# Altium project 191228 Precharge Controller R1.PrjPcb
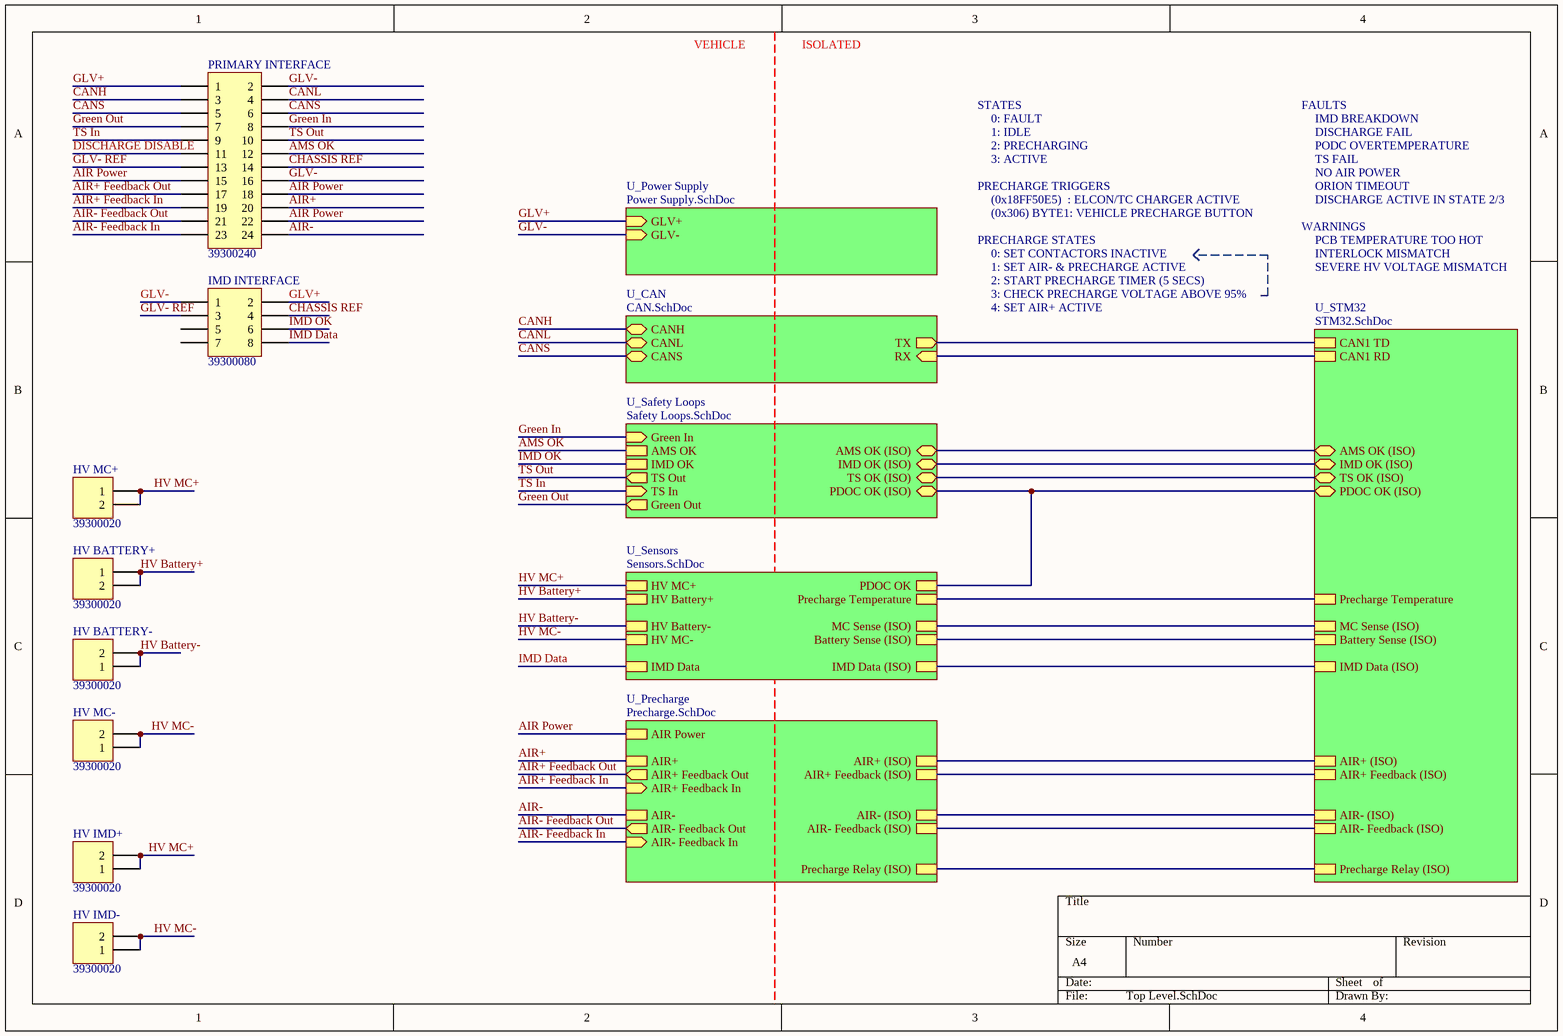
[diagram p0: Top Level.SchDoc]
7 sheets, 260 parts. Net scope: hierarchical (ports join the sheet entries above them; power ports are global).
Board file: 191228 PCB.PcbDoc
Sheets:
  Top Level.SchDoc
    U_CAN = CAN.SchDoc
    U_Power Supply = Power Supply.SchDoc
    U_STM32 = STM32.SchDoc
    U_Safety Loops = Safety Loops.SchDoc
    U_Precharge = Precharge.SchDoc
    U_Sensors = Sensors.SchDoc

## Sheet Top Level.SchDoc
size A4

### Parts
HV_BATTERY+  39300020  [39300020]
HV_BATTERY-  39300020  [39300020]
HV_IMD+  39300020  [39300020]
HV_IMD-  39300020  [39300020]
HV_MC+  39300020  [39300020]
HV_MC-  39300020  [39300020]
IMD_INTERFACE  39300080  [39300080]
PRIMARY_INTERFACE  39300240  [39300240]

### Sub-sheets
U_CAN = CAN.SchDoc: CANH (bidir), CANL (bidir), CANS (bidir), RX (in), TX (out)
U_Power Supply = Power Supply.SchDoc: GLV+ (in), GLV- (in)
U_Precharge = Precharge.SchDoc: AIR Power, AIR- (ISO), AIR- Feedback Out (out), AIR- Feedback (ISO), AIR-, AIR- Feedback In (in), AIR+, AIR+ Feedback Out (out), AIR+ (ISO), AIR+ Feedback (ISO), AIR+ Feedback In (in), Precharge Relay (ISO)
U_Safety Loops = Safety Loops.SchDoc: AMS OK, IMD OK (ISO) (bidir), AMS OK (ISO) (bidir), PDOC OK (ISO) (bidir), TS OK (ISO) (bidir), Green In (in), IMD OK, TS Out (out), TS In (in), Green Out (out)
U_Sensors = Sensors.SchDoc: PDOC OK, HV MC+, HV Battery+, HV MC-, HV Battery-, Precharge Temperature, MC Sense (ISO), Battery Sense (ISO), IMD Data, IMD Data (ISO)
U_STM32 = STM32.SchDoc: CAN1 RD, CAN1 TD, AIR+ (ISO), AIR+ Feedback (ISO), AIR- (ISO), AIR- Feedback (ISO), Precharge Relay (ISO), AMS OK (ISO) (bidir), IMD OK (ISO) (bidir), TS OK (ISO) (bidir), PDOC OK (ISO) (bidir), Precharge Temperature, MC Sense (ISO), Battery Sense (ISO), IMD Data (ISO)

### Nets
AIR+ Feedback In: PRIMARY_INTERFACE.9 PRIMARY_INTERFACE.19 PRIMARY_INTERFACE.23 ; sheet U_Safety Loops/TS In, sheet U_Precharge/AIR- Feedback In, sheet U_Precharge/AIR+ Feedback In  [also labelled AIR- Feedback In, TS In]
HV Battery-: HV_BATTERY-.1 HV_BATTERY-.2 ; sheet U_Sensors/HV Battery-
HV MC-: HV_IMD-.1 HV_IMD-.2 HV_MC-.1 HV_MC-.2 ; sheet U_Sensors/HV MC-
AIR Power: PRIMARY_INTERFACE.15 PRIMARY_INTERFACE.18 PRIMARY_INTERFACE.22 ; sheet U_Precharge/AIR Power
AIR+: PRIMARY_INTERFACE.20 ; sheet U_Precharge/AIR+
AIR+ Feedback Out: PRIMARY_INTERFACE.17 ; sheet U_Precharge/AIR+ Feedback Out
AIR-: PRIMARY_INTERFACE.24 ; sheet U_Precharge/AIR-
AIR- Feedback Out: PRIMARY_INTERFACE.21 ; sheet U_Precharge/AIR- Feedback Out
AMS OK: PRIMARY_INTERFACE.12 ; sheet U_Safety Loops/AMS OK
CANH: PRIMARY_INTERFACE.3 ; sheet U_CAN/CANH
CANL: PRIMARY_INTERFACE.4 ; sheet U_CAN/CANL
CANS: PRIMARY_INTERFACE.5 PRIMARY_INTERFACE.6 ; sheet U_CAN/CANS
CHASSIS REF: IMD_INTERFACE.4 PRIMARY_INTERFACE.14
DISCHARGE DISABLE: PRIMARY_INTERFACE.11
GLV+: IMD_INTERFACE.2 PRIMARY_INTERFACE.1 ; sheet U_Power Supply/GLV+
GLV-: IMD_INTERFACE.1 PRIMARY_INTERFACE.2 PRIMARY_INTERFACE.16 ; sheet U_Power Supply/GLV-
GLV- REF: IMD_INTERFACE.3 PRIMARY_INTERFACE.13
Green In: PRIMARY_INTERFACE.8 ; sheet U_Safety Loops/Green In
Green Out: PRIMARY_INTERFACE.7 ; sheet U_Safety Loops/Green Out
HV Battery+: HV_BATTERY+.1 HV_BATTERY+.2 ; sheet U_Sensors/HV Battery+
HV MC+: HV_IMD+.1 HV_IMD+.2 HV_MC+.1 HV_MC+.2 ; sheet U_Sensors/HV MC+
IMD Data: IMD_INTERFACE.8 ; sheet U_Sensors/IMD Data
IMD OK: IMD_INTERFACE.6 ; sheet U_Safety Loops/IMD OK
PA2: sheet U_STM32/AIR- Feedback (ISO), sheet U_Precharge/AIR- Feedback (ISO)
PA3: sheet U_STM32/AIR+ Feedback (ISO), sheet U_Precharge/AIR+ Feedback (ISO)
PA5: sheet U_STM32/AIR- (ISO), sheet U_Precharge/AIR- (ISO)
PA6: sheet U_STM32/Precharge Relay (ISO), sheet U_Precharge/Precharge Relay (ISO)
PA7: sheet U_STM32/AIR+ (ISO), sheet U_Precharge/AIR+ (ISO)
PB8: sheet U_CAN/RX, sheet U_STM32/CAN1 RD
PB9: sheet U_CAN/TX, sheet U_STM32/CAN1 TD
PB12: sheet U_STM32/IMD OK (ISO), sheet U_Safety Loops/IMD OK (ISO)
PB13: sheet U_STM32/AMS OK (ISO), sheet U_Safety Loops/AMS OK (ISO)
PB14: sheet U_STM32/TS OK (ISO), sheet U_Safety Loops/TS OK (ISO)
PB15: sheet U_STM32/PDOC OK (ISO), sheet U_Safety Loops/PDOC OK (ISO), sheet U_Sensors/PDOC OK
TS Out: PRIMARY_INTERFACE.10 ; sheet U_Safety Loops/TS Out
NetBATT_SENSE_AMP_OUT_TP1_1: sheet U_STM32/Battery Sense (ISO), sheet U_Sensors/Battery Sense (ISO)
NetC29_2: sheet U_STM32/Precharge Temperature, sheet U_Sensors/Precharge Temperature
NetC38_2: sheet U_STM32/MC Sense (ISO), sheet U_Sensors/MC Sense (ISO)
NetR52_2: sheet U_STM32/IMD Data (ISO), sheet U_Sensors/IMD Data (ISO)

Not connected (* = marked no-connect by the designer): IMD_INTERFACE 5 7

### Notes on the sheet
- VEHICLE
- ISOLATED
- STATES
- FAULTS
- 0: FAULT
- 1: IDLE
- 2: PRECHARGING
- 3: ACTIVE
- IMD BREAKDOWN
- DISCHARGE FAIL
- PODC OVERTEMPERATURE
- TS FAIL
- NO AIR POWER
- PRECHARGE STATES
- PRECHARGE TRIGGERS
- (0x18FF50E5)  : ELCON/TC CHARGER ACTIVE
- (0x306) BYTE1: VEHICLE PRECHARGE BUTTON
- WARNINGS
- PCB TEMPERATURE TOO HOT
- ORION TIMEOUT
- DISCHARGE ACTIVE IN STATE 2/3
- 1: SET AIR- & PRECHARGE ACTIVE
- 2: START PRECHARGE TIMER (5 SECS)
- 3: CHECK PRECHARGE VOLTAGE ABOVE 95%
- 4: SET AIR+ ACTIVE
- 0: SET CONTACTORS INACTIVE
- INTERLOCK MISMATCH
- SEVERE HV VOLTAGE MISMATCH

### Library data of the parts
HV_BATTERY+ HV_BATTERY- HV_IMD+ HV_IMD- HV_MC+ HV_MC- = 39300020: Positions: 2; Pitch: 4.2mm; Row Spacing: 5.5mm; Angle: 90; Flange: No; Contact: Tin; Part Number: 39300020; Digikey Part Number: WM21351-ND
IMD_INTERFACE = 39300080: Positions: 8; Pitch: 4.2mm; Row Spacing: 5.5mm; Angle: 90; Flange: No; Contact: Tin; Part Number: 39300080; Digikey Part Number: WM21354-ND
PRIMARY_INTERFACE = 39300240: Positions: 24; Pitch: 4.2mm; Row Spacing: 5.5mm; Angle: 90; Flange: No; Contact: Tin; Part Number: 39300240; Digikey Part Number: WM21362-ND

## Sheet CAN.SchDoc
size A4
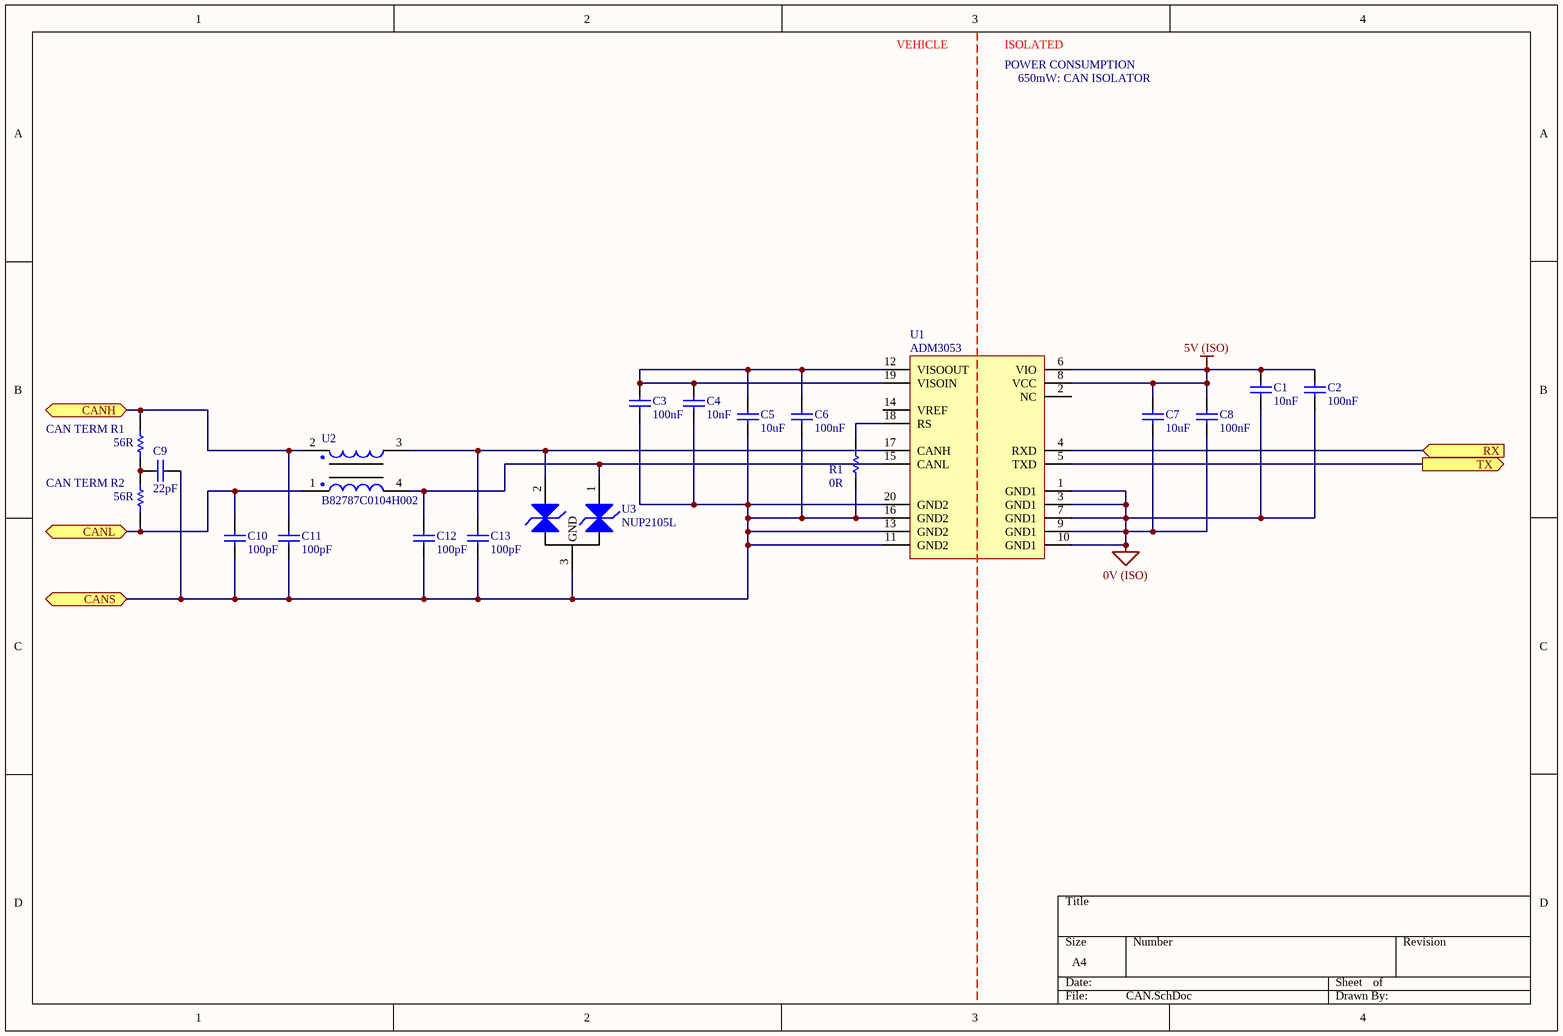
[diagram p1: CAN.SchDoc]

### Parts
C1  10nF  [1206]
C2  100nF  [0805]
C3  100nF  [0805]
C4  10nF  [1206]
C5  10uF  [0805]
C6  100nF  [0805]
C7  10uF  [0805]
C8  100nF  [0805]
C9  22pF  [0805]
C10  100pF  [0805]
C11  100pF  [0805]
C12  100pF  [0805]
C13  100pF  [0805]
CAN_TERM_R1  56R  [0805]
CAN_TERM_R2  56R  [0805]
R1  0R  [0805]
U1  ADM3053  [AD SOIC-W 20]
U2  B82787C0104H002  [TDK 4-PC Pad]
U3  NUP2105L  [ON SOT-23]

### Ports
CANH (bidir), CANL (bidir), CANS (bidir), RX (in), TX (out)

### Nets
0V (ISO): C1.1 C2.1 C7.1 C8.1 U1.1(GND1) U1.3(GND1) U1.7(GND1) U1.9(GND1) U1.10(GND1)
5V (ISO): C1.2 C2.2 C7.2 C8.2 U1.6(VIO) U1.8(VCC)
CANH: C11.2 CAN_TERM_R1.2 U2.2 ; port CANH
CANL: C10.2 CAN_TERM_R2.1 U2.1 ; port CANL
CANS: C3.1 C4.1 C5.1 C6.1 C9.1 C10.1 C11.1 C12.1 C13.1 R1.1 U1.11(GND2) U1.13(GND2) U1.16(GND2) U1.20(GND2) U3.3(GND) ; port CANS
PB8: U1.4(RXD) ; port RX
PB9: U1.5(TXD) ; port TX
NetC3_2: C3.2 C4.2 C5.2 C6.2 U1.12(VISOOUT) U1.19(VISOIN)
NetC9_2: C9.2 CAN_TERM_R1.1 CAN_TERM_R2.2
NetC12_2: C12.2 U1.15(CANL) U2.4 U3.1(CAN_H)
NetC13_2: C13.2 U1.17(CANH) U2.3 U3.2(CAN_L)
NetR1_2: R1.2 U1.18(RS)

Not connected (* = marked no-connect by the designer): U1 2(NC) 14(VREF)

### Notes on the sheet
- VEHICLE
- ISOLATED
- POWER CONSUMPTION
- 650mW: CAN ISOLATOR

### Library data of the parts
C1 C4 = GCM3195C2A103JA16D: Manufacturer: muRata; Tolerance: 5%; Material: Ceramic; Rated Voltage: 100V; Part Number: GCM3195C2A103JA16D; Value: 10nF; Digikey Part Number: 490-4978-2-ND
C2 C3 C6 C8 = GCM21BR71E104KA37L: Manufacturer: muRata; Tolerance: 10%; Material: X7R; Rated Voltage: 25V; Part Number: GCM21BR71E104KA37L; Value: 100nF
C5 C7 = GRM21BR6YA106KE43L: Manufacturer: muRata; Tolerance: 10%; Material: X5R; Rated Voltage: 50V; Part Number: GRM21BR6YA106KE43L; Value: 10uF; Digikey Part Number: 490-10514-6-ND
C9 = GCM21B5C1H220JA37L: Manufacturer: muRata; Tolerance: 5%; Material: C0G; Rated Voltage: 50V; Part Number: GCM21B5C1H220JA37L; Value: 22pF
C10-C13 = GCM21B5C1H101JA37L: Manufacturer: muRata; Tolerance: 5%; Material: C0G; Rated Voltage: 50V; Part Number: GCM21B5C1H101JA37L; Value: 100pF
CAN_TERM_R1 CAN_TERM_R2 = RC0805FR0756RL: Manufacturer: YAGEO; Tolerance: 0.01; Rated Voltage: 0.125W; Part Number: RC0805FR0756RL; Value: 56R; Material: FR-07
R1 = RC0805FR070RL: Manufacturer: YAGEO; Tolerance: 0.01; Rated Voltage: 0.125W; Value: 0R; Part Number: RC0805FR070RL; Material: FR-07; qty: 50
U1 = ADM3053: Isolated CAN Transceiver; Manufacturer: Analogue Devices; Part Number: ADM3053; Digikey Part Number: ADM3053BRWZ-ND; Digikey Link: https://www.digikey.com/product-detail/en/analog-devices-inc/ADM3053BRWZ/ADM3053BRWZ-ND/2709332
U2 = B82787C0104H002: Common mode choke intended for CANBUS 150mA 50V); Manufacturer: EPCOS (TDK); Part Number: B82787C0104H002; Digikey Part Number: 495-4598-2-ND; Digikey Link: https://www.digikey.com/product-detail/en/epcos-tdk/B82787C0104H002/495-4598-2-ND/3680998
U3 = NUP2105L: Dual Line CAN Bus Protector; Manufacturer: ON Semiconductor; Part Number: NUP2105L; Digikey Part Number: NUP2105LT1GOSCT-ND; Digikey Link: https://www.digikey.com/product-detail/en/on-semiconductor/NUP2105LT1G/NUP2105LT1GOSCT-ND/1485001

## Sheet Power Supply.SchDoc
size A4
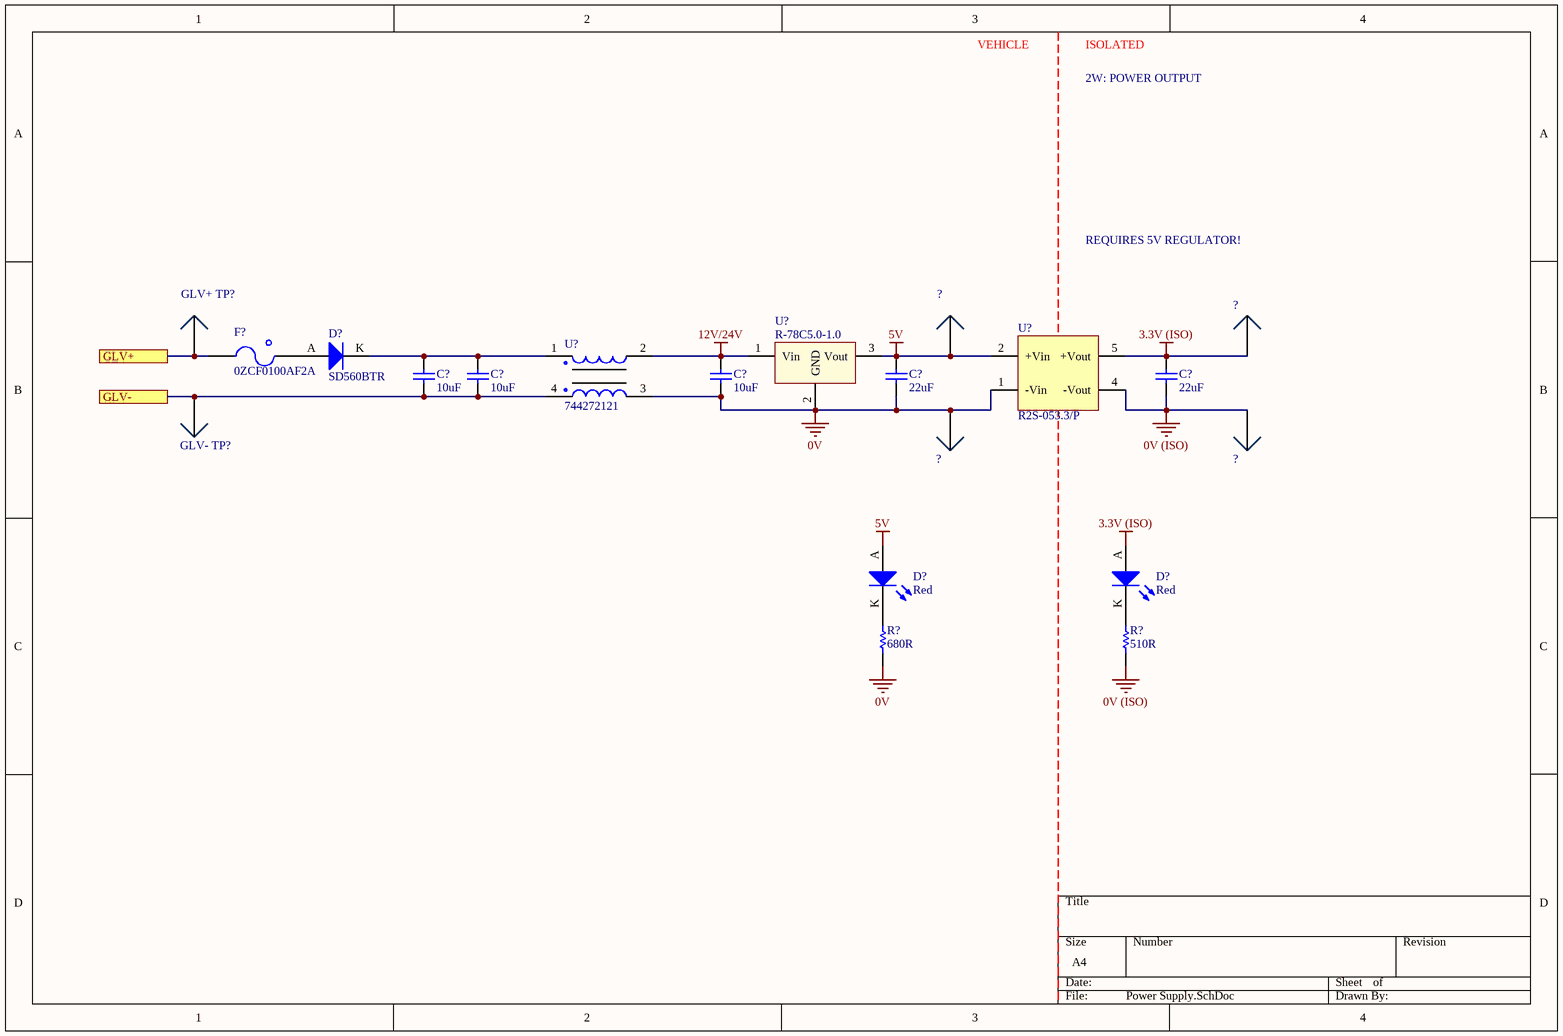
[diagram p2: Power Supply.SchDoc]

### Parts
(Parts that share a designator on the sheet are numbered #1, #2 ... from top to bottom, then left to right.)
?#1  0mm  [SMD Test Point]  (value not drawn)
?#2  0mm  [SMD Test Point]  (value not drawn)
?#3  0mm  [SMD Test Point]  (value not drawn)
?#4  0mm  [SMD Test Point]  (value not drawn)
C?#1  10uF  [0805]
C?#2  10uF  [0805]
C?#3  10uF  [0805]
C?#4  22uF  [1206]
C?#5  22uF  [1206]
D?#1  SD560BTR  [SMB Diode]
D?#2  Red  [0805 LED]
D?#3  Red  [0805 LED]
F?  0ZCF0100AF2A  [2920]
GLV+_TP?  0mm  [SMD Test Point]  (value not drawn)
GLV-_TP?  0mm  [SMD Test Point]  (value not drawn)
R?#1  680R  [0805]
R?#2  510R  [0805]
U?#1  R2S-053.3/P  [RECOM 8-SMD (5 Pin)]
U?#2  744272121  [Wurth 4-PC Pad]
U?#3  R-78C5.0-1.0  [RECOM 3-SIP]

### Ports
GLV+, GLV-

### Nets
0V: ?#3.1 C?#3.1 C?#4.1 R?#1.1 U?#1.1(-Vin) U?#2.3 U?#3.2(GND)  [project net AIR+ Feedback In]
0V (ISO): ?#4.1 C?#5.1 R?#2.1 U?#1.4(-Vout)
3.3V (ISO): ?#2.1 C?#5.2 D?#3.A U?#1.5(+Vout)
5V: ?#1.1 C?#4.2 D?#2.A U?#1.2(+Vin) U?#3.3(Vout)
12V/24V: C?#3.2 U?#2.2 U?#3.1(Vin)
GLV+: F?.1 GLV+_TP?.1 ; port GLV+
GLV-: C?#1.1 C?#2.1 GLV-_TP?.1 U?#2.4 ; port GLV-
NetC?#1_2: C?#1.2 C?#2.2 D?#1.K U?#2.1
NetD?#1_A: D?#1.A F?.2
NetD?#2_K: D?#2.K R?#1.2
NetD?#3_K: D?#3.K R?#2.2

### Notes on the sheet
- VEHICLE
- ISOLATED
- 2W: POWER OUTPUT
- REQUIRES 5V REGULATOR!

### Library data of the parts
?#1-?#4 GLV+_TP? GLV-_TP? = SMD Test Point: Positions: 1; Row Spacing: 0; Flange: No; Contact: NA; Part Number: SMD Test Point; Pitch: 0mm; Angle: 0
C?#1-C?#3 = GRM21BR6YA106KE43L: as C5 on sheet CAN; Part Number: GRM21BR6YA106KE43L; Value: 10uF; Digikey Part Number: 490-10514-6-ND
C?#4 C?#5 = CC1206MKX5R7BB226: Manufacturer: YAGEO; Tolerance: 20%; Material: Ceramic; Rated Voltage: 16V; Part Number: CC1206MKX5R7BB226; Value: 22uF; Digikey Part Number: 311-1997-2-ND
D?#1 = SD560BTR: 1.2V_F 600V 5A SMB; Manufacturer: SMC Diode Solutions; Part Number: SD560BTR; Digikey Part Number: 1655-1530-2-ND; Digikey Link: https://www.digikey.com/product-detail/en/smc-diode-solutions/SD560BTR/1655-1530-2-ND/6022620
D?#2 D?#3 = SML-210LTT86: Red LED Indication - Discrete 1.75V 0805 (2012 Metric); Manufacturer: ROHM Semiconductor; Part Number: SML-210LTT86; Colour: Red; Digikey Part Number: 511-1286-1-ND; Digikey Link: https://www.digikey.com/product-detail/en/rohm-semiconductor/SML-210LTT86/511-1286-1-ND/637099
F? = 0ZCF0100AF2A: PTC RESET FUSE 60V 1A 292; Manufacturer: Littelfuse Inc.; Part Number: 0ZCF0100AF2A; Digikey Part Number: 507-2070-1-ND; Digikey Link: https://www.digikey.com/product-detail/en/bel-fuse-inc/0ZCF0100AF2A/507-2070-1-ND/6210547
R?#1 = RC0805FR07680RL: Manufacturer: YAGEO; Tolerance: 0.01; Rated Voltage: 0.125W; Part Number: RC0805FR07680RL; Value: 680R; Material: FR-07
R?#2 = RC0805FR07510RL: Manufacturer: YAGEO; Tolerance: 0.01; Rated Voltage: 0.125W; Part Number: RC0805FR07510RL; Value: 510R; Material: FR-07
U?#1 = R2S-053.3/P: Isolated Module DC DC Converter 1 Output 3.3V 606mA 4.5V - 5.5V Input; Manufacturer: Recom; Output Power: 2W; Efficiency: 0.75; Part Number: R2S-053.3/P; Input Voltage: 4.5V-5.5V; Output Voltage: 3.3V; Isolation: Isolated; Digikey Part Number: 945-2677-5-ND; Digikey Link: https://www.digikey.com/product-detail/en/recom-power/R2S-053.3-P/945-2677-5-ND/2302804
U?#2 = 744272121: 120µH @ 100kHz 2 Line Common Mode Choke Surface Mount 460 Ohms @ 30MHz 2.5A DCR 25mOhm; Manufacturer: Wurth Electronics Inc; Inductance: 120uH @ 100kHz; Part Number: 744272121; Impedence: 460 Ohms @ 30MHz; Material: Wirewound; Rated Current: 2.5A; Digikey Part Number: 732-1489-1-ND; Digikey Link: https://www.digikey.com/product-detail/en/w-rth-elektronik/744272121/732-1489-1-ND/1639501
U?#3 = R-78C5.0-1.0: CONV DC/DC 1A 5V OUT SIP VERT; Manufacturer: Recom; Isolation: Non-Isolated; Part Number: R-78C5.0-1.0; Digikey Part Number: 945-1395-5-ND; Digikey Link: https://www.digikey.com.au/product-detail/en/recom-power/R-78C5.0-1.0/945-1395-5-ND/2652148

## Sheet STM32.SchDoc
size A3
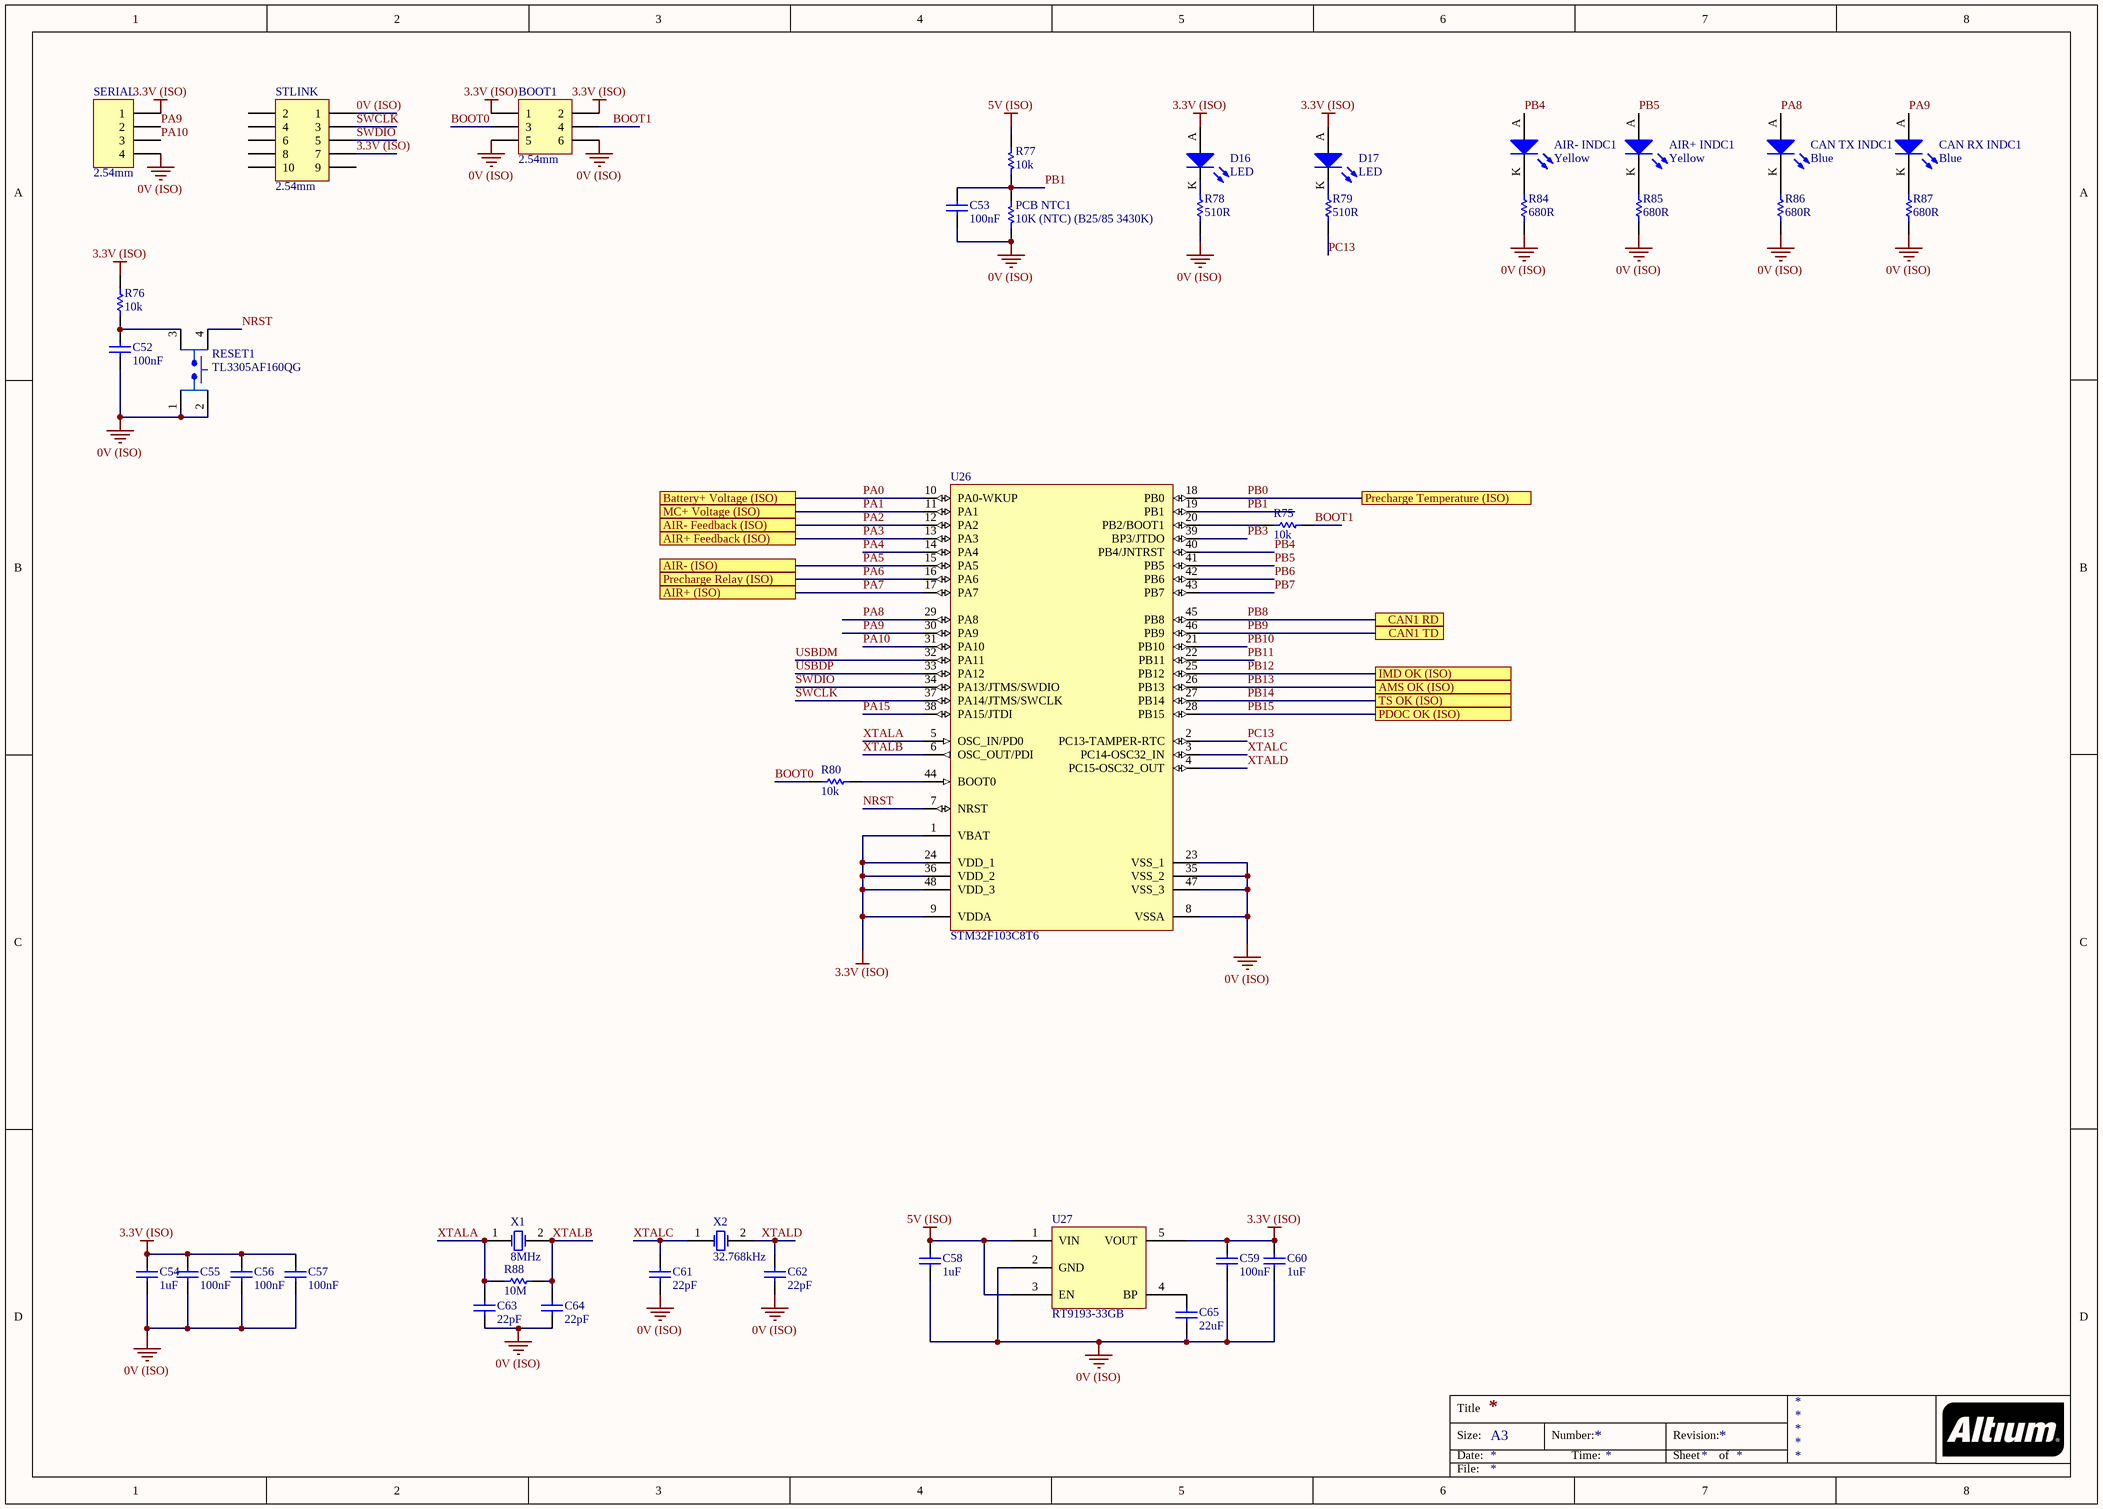
[diagram p3: STM32.SchDoc]

### Parts
AIR+_INDC1  Yellow  [0805 LED]
AIR-_INDC1  Yellow  [0805 LED]
BOOT1  2.54mm  [TH 2.54mm Header 2x3]
C52  100nF  [0805]
C53  100nF  [0805]
C54  1uF  [0805]
C55  100nF  [0805]
C56  100nF  [0805]
C57  100nF  [0805]
C58  1uF  [0805]
C59  100nF  [0805]
C60  1uF  [0805]
C61  22pF  [0805]
C62  22pF  [0805]
C63  22pF  [0805]
C64  22pF  [0805]
C65  22uF  [0805]
CAN_RX_INDC1  Blue  [0805 LED]
CAN_TX_INDC1  Blue  [0805 LED]
D16  LED  [0805 LED]
D17  LED  [0805 LED]
PCB_NTC1  10K (NTC) (B25/85 3430K)  [0805]
R75  10k  [0805]
R76  10k  [0805]
R77  10k  [0805]
R78  510R  [0805]
R79  510R  [0805]
R80  10k  [0805]
R84  680R  [0805]
R85  680R  [0805]
R86  680R  [0805]
R87  680R  [0805]
R88  10M  [0805]
RESET1  TL3305AF160QG  [E-Switch SPST GULL]
SERIAL  2.54mm  [TH 2.54mm Header 1x4]
STLINK  2.54mm  [TH 2.54mm Header 2x5]
U26  STM32F103C8T6  [STM 48-LQFP]
U27  RT9193-33GB  [RICHTEK SOT-23-5]
X1  8MHz  [Abracon HC-49/US]
X2  32.768kHz  [EPSON 2-SMD]

### Ports
AIR+ (ISO), AIR+ Feedback (ISO), AIR- (ISO), AIR- Feedback (ISO), AMS OK (ISO), Battery+ Voltage (ISO), CAN1 RD, CAN1 TD, IMD OK (ISO), MC+ Voltage (ISO), PDOC OK (ISO), Precharge Relay (ISO), Precharge Temperature (ISO), TS OK (ISO)

### Nets
0V (ISO): BOOT1.5 BOOT1.6 C52.1 C53.1 C54.1 C55.1 C56.1 C57.1 C58.1 C59.1 C60.1 C61.1 C62.1 C63.1 C64.1 C65.1 PCB_NTC1.1 R78.1 R84.1 R85.1 R86.1 R87.1 RESET1.1(VDD) RESET1.2(VDD) SERIAL.4 STLINK.1 U26.8(VSSA) U26.23(VSS_1) U26.35(VSS_2) U26.47(VSS_3) U27.2(GND)
3.3V (ISO): BOOT1.1 BOOT1.2 C54.2 C55.2 C56.2 C57.2 C59.2 C60.2 D16.A D17.A R76.2 SERIAL.1 STLINK.7 U26.1(VBAT) U26.9(VDDA) U26.24(VDD_1) U26.36(VDD_2) U26.48(VDD_3) U27.5(VOUT)
5V (ISO): C58.2 R77.2 U27.1(VIN) U27.3(EN)
BOOT0: BOOT1.3 R80.1
BOOT1: BOOT1.4 R75.2
NRST: RESET1.4(VDD) U26.7(NRST)
PA0: U26.10(PA0-WKUP) ; port Battery+ Voltage (ISO)
PA1: U26.11(PA1) ; port MC+ Voltage (ISO)
PA2: U26.12(PA2) ; port AIR- Feedback (ISO)
PA3: U26.13(PA3) ; port AIR+ Feedback (ISO)
PA4: U26.14(PA4)
PA5: U26.15(PA5) ; port AIR- (ISO)
PA6: U26.16(PA6) ; port Precharge Relay (ISO)
PA7: U26.17(PA7) ; port AIR+ (ISO)
PA8: CAN_TX_INDC1.A U26.29(PA8)
PA9: CAN_RX_INDC1.A SERIAL.2 U26.30(PA9)
PA10: SERIAL.3 U26.31(PA10)
PA15: U26.38(PA15/JTDI)
PB0: U26.18(PB0) ; port Precharge Temperature (ISO)
PB1: C53.2 PCB_NTC1.2 R77.1 U26.19(PB1)
PB3: U26.39(BP3/JTDO)
PB4: AIR-_INDC1.A U26.40(PB4/JNTRST)
PB5: AIR+_INDC1.A U26.41(PB5)
PB6: U26.42(PB6)
PB7: U26.43(PB7)
PB8: U26.45(PB8) ; port CAN1 RD
PB9: U26.46(PB9) ; port CAN1 TD
PB10: U26.21(PB10)
PB11: U26.22(PB11)
PB12: U26.25(PB12) ; port IMD OK (ISO)
PB13: U26.26(PB13) ; port AMS OK (ISO)
PB14: U26.27(PB14) ; port TS OK (ISO)
PB15: U26.28(PB15) ; port PDOC OK (ISO)
PC13: R79.1 U26.2(PC13-TAMPER-RTC)
SWCLK: STLINK.3 U26.37(PA14/JTMS/SWCLK)
SWDIO: STLINK.5 U26.34(PA13/JTMS/SWDIO)
USBDM: U26.32(PA11)
USBDP: U26.33(PA12)
XTALA: C63.2 R88.1 U26.5(OSC_IN/PD0) X1.1(OSC1)
XTALB: C64.2 R88.2 U26.6(OSC_OUT/PDI) X1.2(OSC2)
XTALC: C61.2 U26.3(PC14-OSC32_IN) X2.1(OSC1)
XTALD: C62.2 U26.4(PC15-OSC32_OUT) X2.2(OSC2)
NetAIR+_INDC1_K: AIR+_INDC1.K R85.2
NetAIR-_INDC1_K: AIR-_INDC1.K R84.2
NetC52_2: C52.2 R76.1 RESET1.3(VDD)
NetC65_2: C65.2 U27.4(BP)
NetCAN_RX_INDC1_K: CAN_RX_INDC1.K R87.2
NetCAN_TX_INDC1_K: CAN_TX_INDC1.K R86.2
NetD16_K: D16.K R78.2
NetD17_K: D17.K R79.2
NetR75_1: R75.1 U26.20(PB2/BOOT1)
NetR80_2: R80.2 U26.44(BOOT0)

Not connected (* = marked no-connect by the designer): STLINK 2 4 6 8 9 10

### Notes on the sheet
- Title
- Size:
- Date:
- A3
- Number:
- Time:
- Revision:
- Sheet
- of
- File:

### Library data of the parts
AIR+_INDC1 AIR-_INDC1 = SML-211YTT86: Yellow LED Indication - Discrete 1.75V 0805 (2012 Metric); Manufacturer: ROHM Semiconductor; Part Number: SML-211YTT86; Colour: Yellow; Digikey Part Number: 511-1293-1-ND; Digikey Link: https://www.digikey.com/product-detail/en/rohm-semiconductor/SML-211YTT86/511-1293-1-ND/637106
BOOT1 = TH 2.54mm Header 2x3: Positions: 6; Angle: 0; Flange: No; Contact: NA; Part Number: TH 2.54mm Header 2x3; Pitch: 2.54mm; Row Spacing: 2.54mm
C52 C53 C55-C57 C59 = GCM21BR71E104KA37L: as C2 on sheet CAN; Part Number: GCM21BR71E104KA37L; Value: 100nF
C54 C58 C60 = GCM21BR71A105KA37L: Manufacturer: muRata; Tolerance: 10%; Material: X7R; Rated Voltage: 10V; Part Number: GCM21BR71A105KA37L; Value: 1uF
C61-C64 = GCM21B5C1H220JA37L: as C9 on sheet CAN; Part Number: GCM21B5C1H220JA37L; Value: 22pF
C65 = GRM21BR61A226ME51L: Manufacturer: muRata; Tolerance: 20%; Material: X5R; Rated Voltage: 10V; Part Number: GRM21BR61A226ME51L; Value: 22uF; Digikey Part Number: 490-10511-1-ND
CAN_RX_INDC1 CAN_TX_INDC1 = SML-MN2BCTT86C: LED BLUE CLEAR 2012 SMD; Manufacturer: ROHM Semiconductor; Part Number: SML-MN2BCTT86C; Colour: Blue; Digikey Part Number: 846-1207-1-ND; Digikey Link: https://www.digikey.com/product-detail/en/rohm-semiconductor/SMLMN2BCTT86C/846-1207-1-ND/6057239
D16 D17 = LED: Red LED Indication - Discrete 1.75V 0805 (2012 Metric); Manufacturer: ROHM Semiconductor; Part Number: SML-210LTT86; Colour: Red; Digikey Part Number: 511-1286-1-ND; Digikey Link: https://www.digikey.com/product-detail/en/rohm-semiconductor/SML-210LTT86/511-1286-1-ND/637099
PCB_NTC1 = NTCS0805E3103FLT: Manufacturer: Vishay Beyschlag; Tolerance: 0.01; Rated Voltage: 210mW; Part Number: NTCS0805E3103FLT; Value: 10K (NTC) (B25/85 3430K); Digikey Part Number: BC2733CT-ND
R75-R77 R80 = RC0805FR0710KL: Manufacturer: YAGEO; Tolerance: 0.01; Rated Voltage: 0.125W; Part Number: RC0805FR0710KL; Value: 10k; Material: FR-07
  R75: qty: 50
R78 R79 = RC0805FR07510RL: as R?#2 on sheet Power Supply; Part Number: RC0805FR07510RL; Value: 510R; Material: FR-07
R84-R87 = RC0805FR07680RL: as R?#1 on sheet Power Supply; Part Number: RC0805FR07680RL; Value: 680R; Material: FR-07
R88 = RC0805FR0710ML: Manufacturer: YAGEO; Tolerance: 0.01; Rated Voltage: 0.125W; Part Number: RC0805FR0710ML; Value: 10M; Material: FR-07
RESET1 = TL3305AF160QG: Tactile Switch SPST-NO Top Actuated Surface Mount; Manufacturer: E-Switch; Part Number: TL3305AF160QG; Digikey Part Number: EG5350TR-ND; Digikey Link: https://www.digikey.com/product-detail/en/e-switch/TL3305AF160QG/EG5350TR-ND/5816181
SERIAL = TH 2.54mm Header 1x4: Positions: 4; Angle: 0; Flange: No; Contact: NA; Part Number: TH 2.54mm Header 1x4; Pitch: 2.54mm; Row Spacing: 2.54mm
STLINK = TH 2.54mm Header 2x5: Positions: 10; Angle: 0; Flange: No; Contact: NA; Part Number: TH 2.54mm Header 2x5; Pitch: 2.54mm; Row Spacing: 2.54mm
U26 = STM32F103C8T6: ARM® Cortex®-M3 STM32F1 Microcontroller IC 32-Bit 72MHz 64KB (64K x 8) FLASH; Manufacturer: STMicroelectronics; Part Number: STM32F103C8T6; Digikey Part Number: 497-6063-ND; Digikey Link: https://www.digikey.com/product-detail/en/stmicroelectronics/STM32F103C8T6/497-6063-ND/1646338
U27 = RT9193-33GB: IC REG LINEAR 3.3V 300MA SOT23-5; Manufacturer: Richtek; Part Number: RT9193-33GB; Digikey Part Number: 1028-1014-1-ND; Digikey Link: https://www.digikey.com/products/en?keywords=1028-1014-1-ND
X1 = ABLS-8.000MHZ-B4-T: Manufacturer: Abracon LLC; Load Capacitance: 18pF; ESR: 80R; Part Number: ABLS-8.000MHZ-B4-T; Value: 8MHz; Digikey Part Number: 535-10212-2-ND; Digikey Link: https://www.digikey.com/product-detail/en/abracon-llc/ABLS-8.000MHZ-B4-T/535-10212-2-ND/2184155
X2 = FC-135 32.7680KA-A5: Manufacturer: EPSON; Load Capacitance: 12.5pF; ESR: 70k; Part Number: FC-135 32.7680KA-A5; Value: 32.768kHz; Digikey Part Number: SER4103TR-ND; Digikey Link: https://www.digikey.com/product-detail/en/epson/FC-135-32.7680KA-A5/SER4103TR-ND/5259895

## Sheet Safety Loops.SchDoc
size A3 portrait
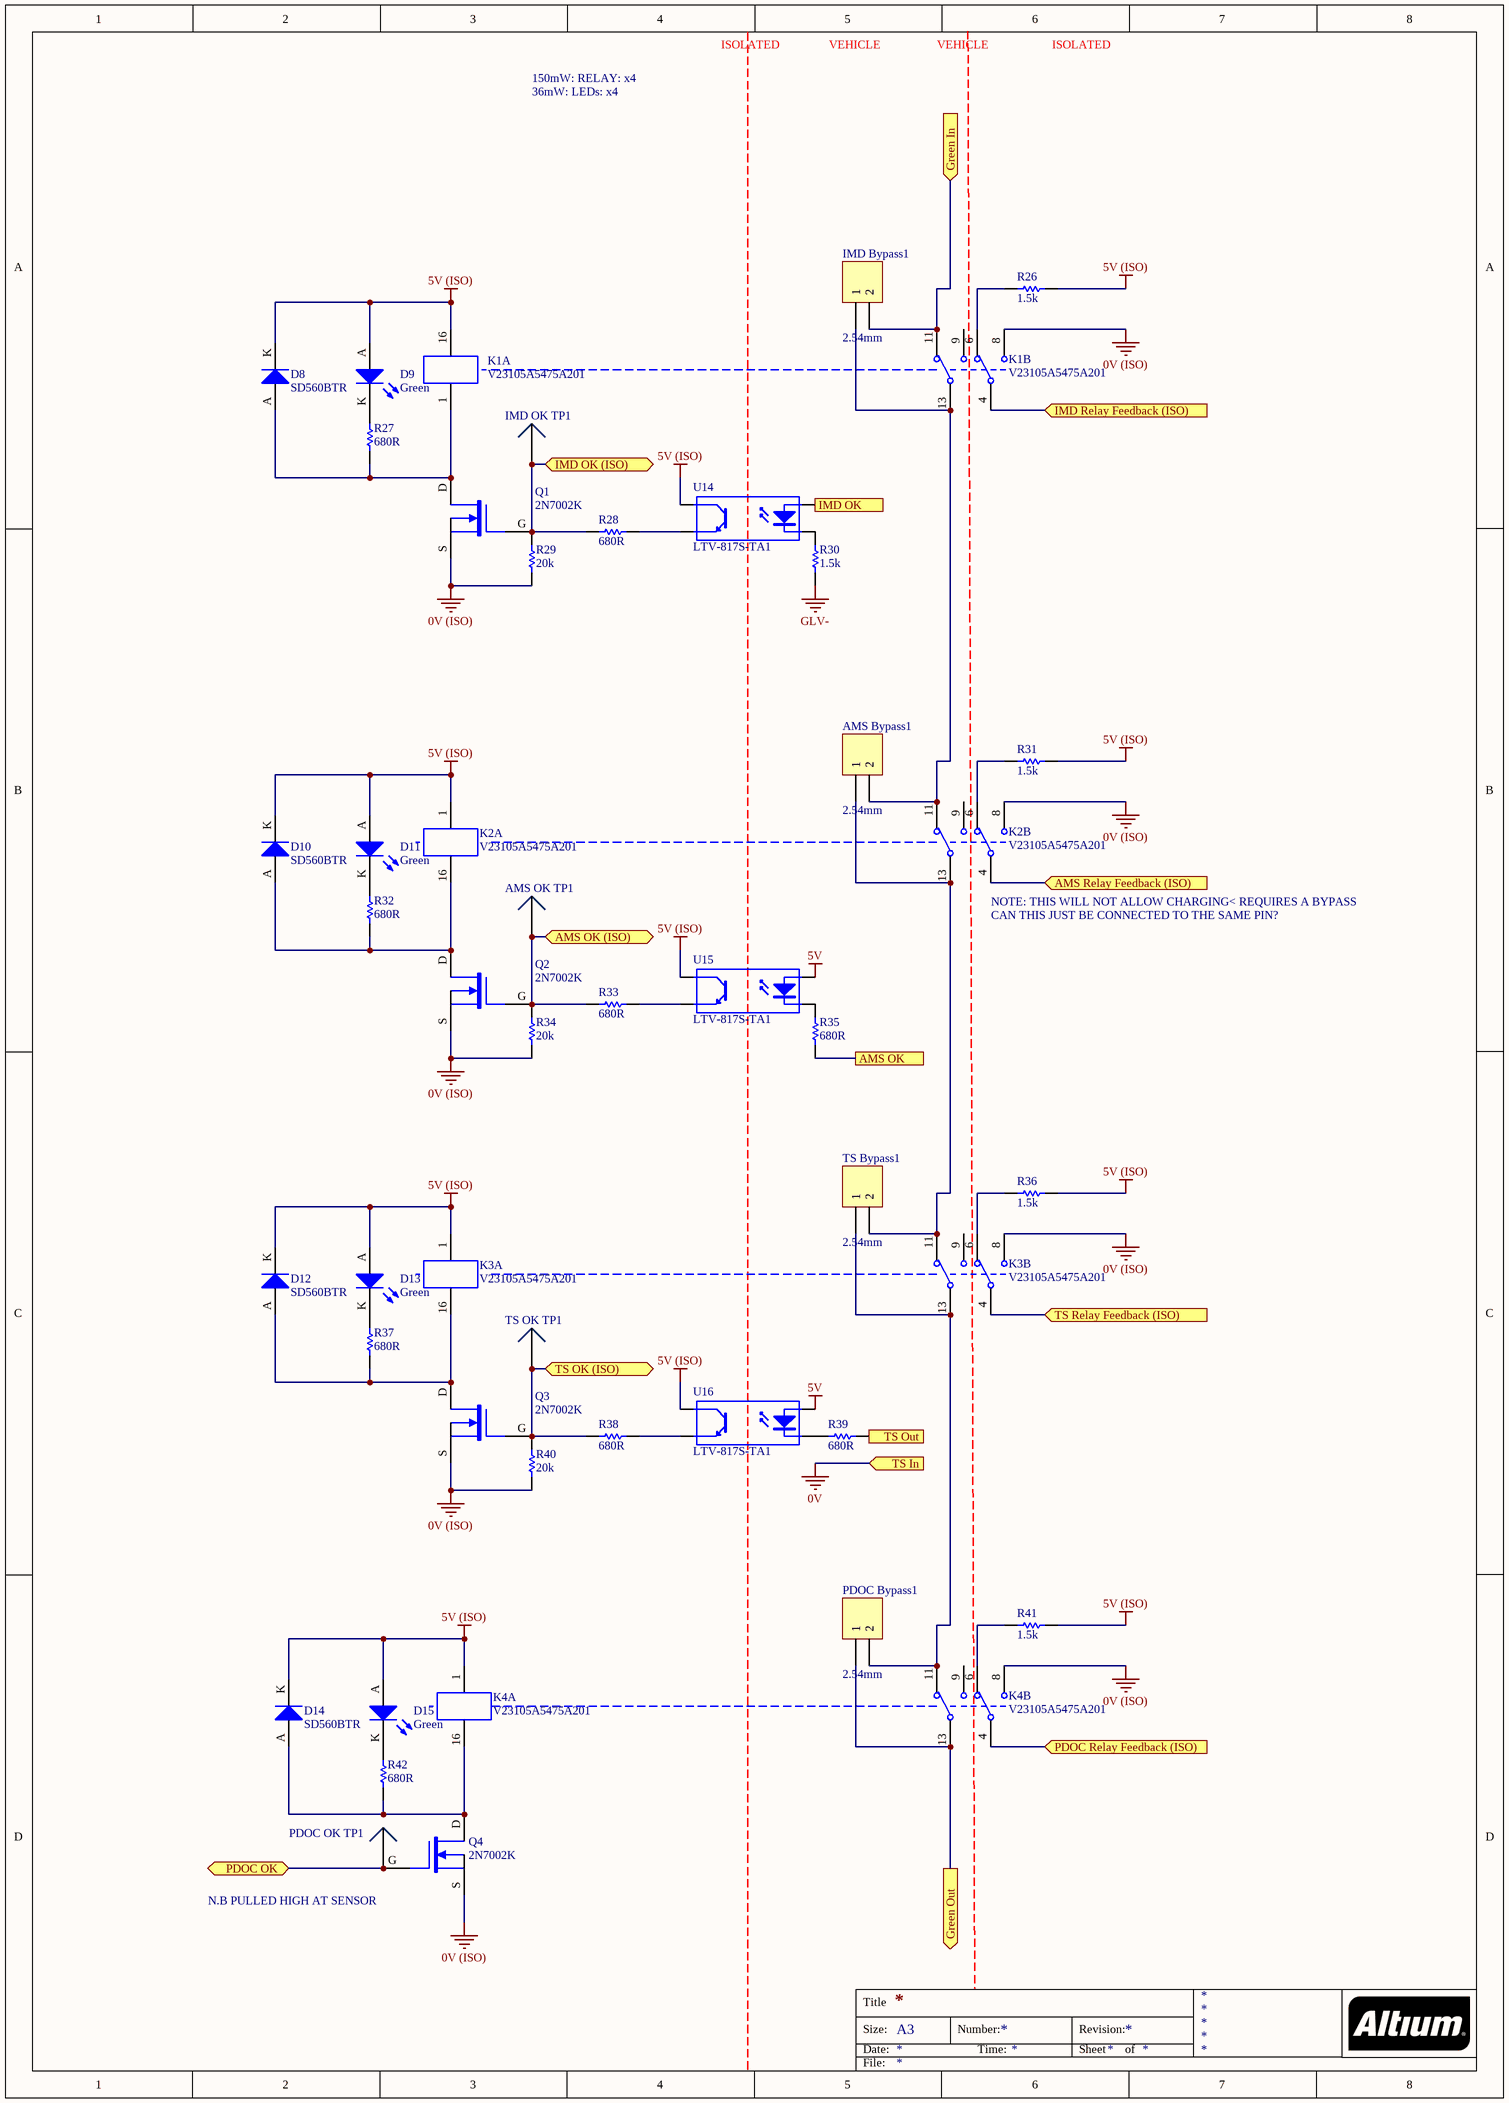
[diagram p4: Safety Loops.SchDoc]

### Parts
AMS_Bypass1  2.54mm  [TH 2.54mm Header 1x2]
AMS_OK_TP1  0mm  [SMD Test Point]  (value not drawn)
D8  SD560BTR  [SMB Diode]
D9  Green  [0805 LED]
D10  SD560BTR  [SMB Diode]
D11  Green  [0805 LED]
D12  SD560BTR  [SMB Diode]
D13  Green  [0805 LED]
D14  SD560BTR  [SMB Diode]
D15  Green  [0805 LED]
IMD_Bypass1  2.54mm  [TH 2.54mm Header 1x2]
IMD_OK_TP1  0mm  [SMD Test Point]  (value not drawn)
K1  V23105A5475A201  [TI 2-DIL]  (parts A,B of 2)
K2  V23105A5475A201  [TI 2-DIL]  (parts A,B of 2)
K3  V23105A5475A201  [TI 2-DIL]  (parts A,B of 2)
K4  V23105A5475A201  [TI 2-DIL]  (parts A,B of 2)
PDOC_Bypass1  2.54mm  [TH 2.54mm Header 1x2]
PDOC_OK_TP1  0mm  [SMD Test Point]  (value not drawn)
Q1  2N7002K  [SOT-343_N]
Q2  2N7002K  [SOT-343_N]
Q3  2N7002K  [SOT-343_N]
Q4  2N7002K  [SOT-343_N]
R26  1.5k  [0805]
R27  680R  [0805]
R28  680R  [0805]
R29  20k  [0805]
R30  1.5k  [0805]
R31  1.5k  [0805]
R32  680R  [0805]
R33  680R  [0805]
R34  20k  [0805]
R35  680R  [0805]
R36  1.5k  [0805]
R37  680R  [0805]
R38  680R  [0805]
R39  680R  [0805]
R40  20k  [0805]
R41  1.5k  [0805]
R42  680R  [0805]
TS_Bypass1  2.54mm  [TH 2.54mm Header 1x2]
TS_OK_TP1  0mm  [SMD Test Point]  (value not drawn)
U14  LTV-817S-TA1  [ON 4-SMD]
U15  LTV-817S-TA1  [ON 4-SMD]
U16  LTV-817S-TA1  [ON 4-SMD]

### Ports
AMS OK, AMS OK (ISO) (bidir), AMS Relay Feedback (ISO) (in), Green In (in), Green Out (out), IMD OK, IMD OK (ISO) (bidir), IMD Relay Feedback (ISO) (in), PDOC OK (bidir), PDOC Relay Feedback (ISO) (in), TS In (in), TS OK (ISO) (bidir), TS Out (out), TS Relay Feedback (ISO) (in)

### Nets
0V (ISO): K1.8 K2.8 K3.8 K4.8 Q1.S Q2.S Q3.S Q4.S R29.1 R34.1 R40.1
5V: U15.1(A) U16.1(A)
5V (ISO): D8.K D9.A D10.K D11.A D12.K D13.A D14.K D15.A K1.16 K2.1 K3.1 K4.1 R26.2 R31.2 R36.2 R41.2 U14.4(C) U15.4(C) U16.4(C)
GLV-: R30.1
AMS OK: R35.1 ; port AMS OK
Green In: IMD_Bypass1.2 K1.11 ; port Green In
Green Out: K4.13 PDOC_Bypass1.1 ; port Green Out
IMD OK: U14.1(A) ; port IMD OK
PB12: IMD_OK_TP1.1 Q1.G R28.1 R29.2 ; port IMD OK (ISO)
PB13: AMS_OK_TP1.1 Q2.G R33.1 R34.2 ; port AMS OK (ISO)
PB14: Q3.G R38.1 R40.2 TS_OK_TP1.1 ; port TS OK (ISO)
TS Out: R39.2 ; port TS Out
NetAMS_Bypass1_1: AMS_Bypass1.1 K2.13 K3.11 TS_Bypass1.2
NetAMS_Bypass1_2: AMS_Bypass1.2 IMD_Bypass1.1 K1.13 K2.11
NetD8_A: D8.A K1.1 Q1.D R27.1
NetD9_K: D9.K R27.2
NetD10_A: D10.A K2.16 Q2.D R32.1
NetD11_K: D11.K R32.2
NetD12_A: D12.A K3.16 Q3.D R37.1
NetD13_K: D13.K R37.2
NetD14_A: D14.A K4.16 Q4.D R42.1
NetD15_K: D15.K R42.2
NetK1_4: K1.4 ; port IMD Relay Feedback (ISO)
NetK1_6: K1.6 R26.1
NetK2_4: K2.4 ; port AMS Relay Feedback (ISO)
NetK2_6: K2.6 R31.1
NetK3_4: K3.4 ; port TS Relay Feedback (ISO)
NetK3_6: K3.6 R36.1
NetK3_13: K3.13 K4.11 PDOC_Bypass1.2 TS_Bypass1.1
NetK4_4: K4.4 ; port PDOC Relay Feedback (ISO)
NetK4_6: K4.6 R41.1
NetPDOC_OK_TP1_1: PDOC_OK_TP1.1 Q4.G ; port PDOC OK
NetR28_2: R28.2 U14.3(E)
NetR30_2: R30.2 U14.2(K)
NetR33_2: R33.2 U15.3(E)
NetR35_2: R35.2 U15.2(K)
NetR38_2: R38.2 U16.3(E)
NetR39_1: R39.1 U16.2(K)

Not connected (* = marked no-connect by the designer): K1 9; K2 9; K3 9; K4 9

### Notes on the sheet
- 150mW: RELAY: x4
- 36mW: LEDs: x4
- ISOLATED
- VEHICLE
- (near K2) NOTE: THIS WILL NOT ALLOW CHARGING< REQUIRES A BYPASS
- CAN THIS JUST BE CONNECTED TO THE SAME PIN?
- N.B PULLED HIGH AT SENSOR
- Title
- Size:
- Date:
- A3
- Number:
- Time:
- Revision:
- Sheet
- of
- File:

### Library data of the parts
AMS_Bypass1 IMD_Bypass1 PDOC_Bypass1 TS_Bypass1 = TH 2.54mm Header 1x2: Positions: 2; Angle: 0; Flange: No; Contact: NA; Part Number: TH 2.54mm Header 1x2; Pitch: 2.54mm; Row Spacing: 2.54mm
AMS_OK_TP1 IMD_OK_TP1 PDOC_OK_TP1 TS_OK_TP1 = SMD Test Point: as ?#1 on sheet Power Supply; Part Number: SMD Test Point; Pitch: 0mm; Angle: 0
D8 D10 D12 D14 = SD560BTR: as D?#1 on sheet Power Supply; Part Number: SD560BTR; Digikey Part Number: 1655-1530-2-ND; Digikey Link: https://www.digikey.com/product-detail/en/smc-diode-solutions/SD560BTR/1655-1530-2-ND/6022620
D9 D11 D13 D15 = SML-210FTT86: Green LED Indication - Discrete 1.75V 0805 (2012 Metric); Manufacturer: ROHM Semiconductor; Part Number: SML-210FTT86; Colour: Green; Digikey Part Number: 511-1285-1-ND; Digikey Link: https://www.digikey.com/product-detail/en/rohm-semiconductor/SML-210FTT86/511-1285-1-ND/637098
K1-K4 = V23105A5475A201: 5V DPDT Relay 3A 220VDC; Manufacturer: Axicom; Part Number: V23105A5475A201; Digikey Part Number: PB383-ND; Digikey Link: https://www.digikey.com/products/en?mpart=V23105A5001A201&v=41
Q1-Q4 = 2N7002K: 60V 380mA, NFET MOSTFET (Small Signal); Manufacturer: ON Semiconductor; Published: 24-Mar-1999; LatestRevisionDate: 29-May-2009; LatestRevisionNote: IPC-7351 Footprint Added.; PackageVersion: Sep-2000; PackageReference: SOT-343; Publisher: Altium Limited; PackageDescription: 4-Pin SOT-343 Package 1.3 mm Pitch, 2.1 mm Lead Span; Part Number: 2N7002K; Digikey Part Number: 2N7002KCT-ND; Digikey Link: https://www.digikey.com/product-detail/en/on-semiconductor/2N7002K/2N7002KCT-ND/2060375; Qty: 30
R26 R30 R31 R36 R41 = RC0805FR071K5L: Manufacturer: YAGEO; Tolerance: 0.01; Rated Voltage: 0.125W; Part Number: RC0805FR071K5L; Value: 1.5k; Material: FR-07
R27 R28 R32 R33 R35 R37-R39 R42 = RC0805FR07680RL: as R?#1 on sheet Power Supply; Part Number: RC0805FR07680RL; Value: 680R; Material: FR-07
R29 R34 R40 = RC0805FR0720KL: Manufacturer: YAGEO; Tolerance: 0.01; Rated Voltage: 0.125W; Part Number: RC0805FR0720KL; Value: 20k; Material: FR-07
U14-U16 = LTV-817S-TA1: 35V 50ma Optocoupler (VF=1.2V); Manufacturer: Lite-On Inc; Part Number: LTV-817S-TA1; Digikey Part Number: 160-1893-2-ND; Digikey Link: https://www.digikey.com/product-detail/en/lite-on-inc/LTV-817S-TA1/160-1893-2-ND/388451

## Sheet Precharge.SchDoc
size A3
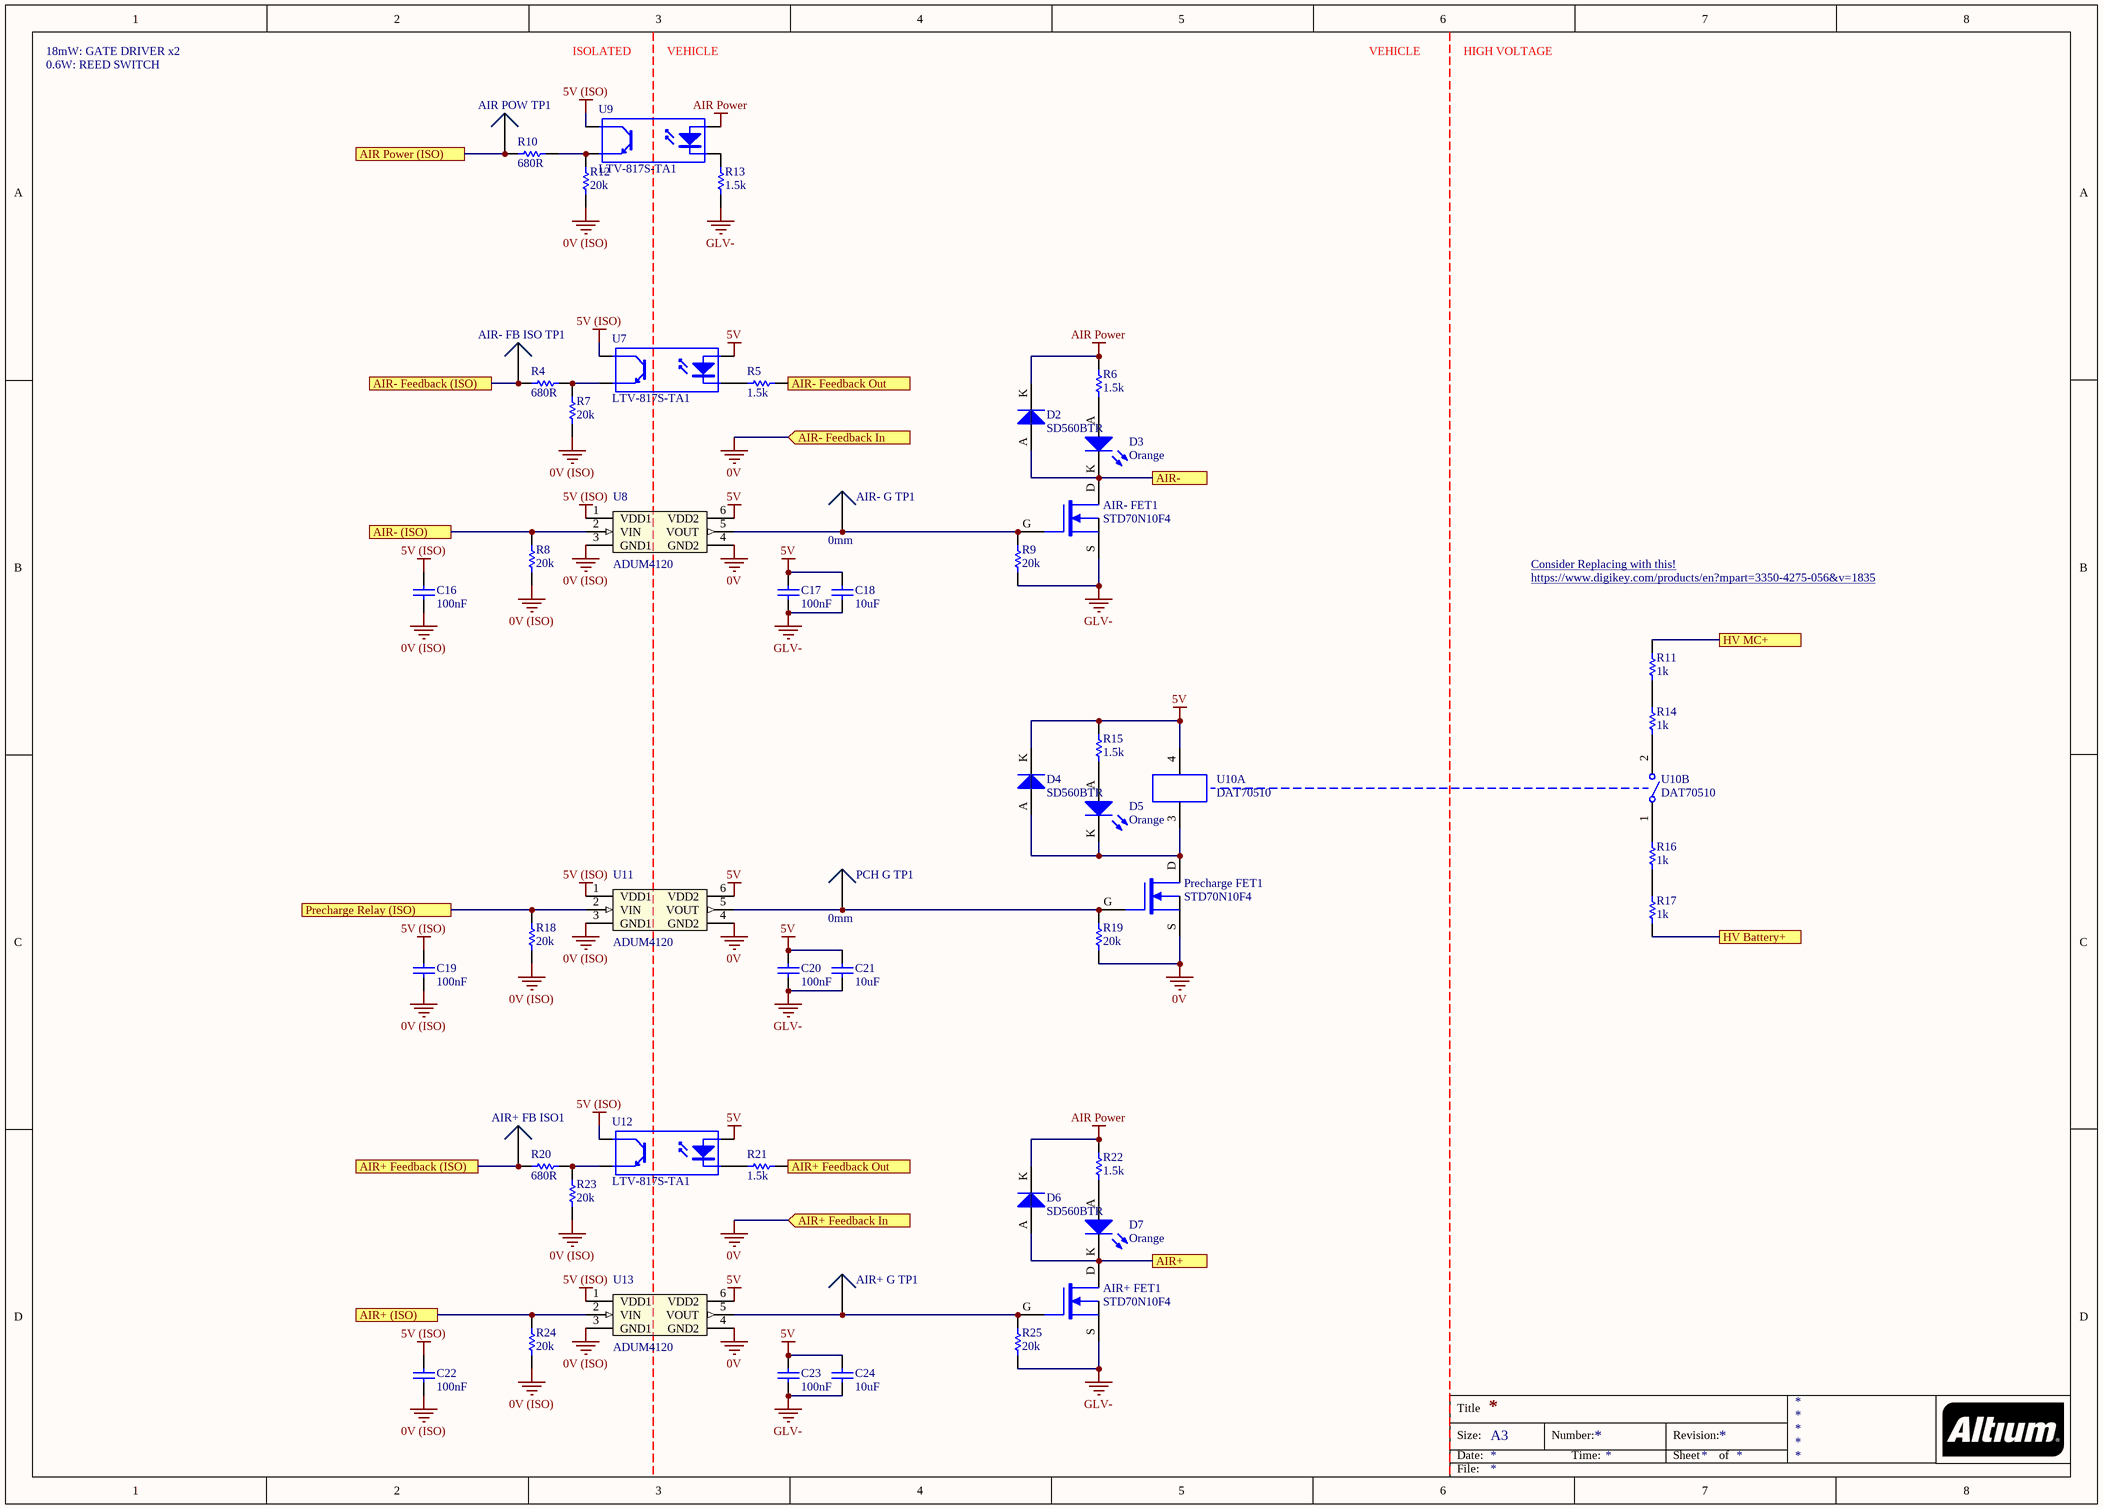
[diagram p5: Precharge.SchDoc]

### Parts
AIR+_FB_ISO1  0mm  [SMD Test Point]  (value not drawn)
AIR+_FET1  STD70N10F4  [SOT-343_N]
AIR+_G_TP1  0mm  [SMD Test Point]  (value not drawn)
AIR-_FB_ISO_TP1  0mm  [SMD Test Point]  (value not drawn)
AIR-_FET1  STD70N10F4  [SOT-343_N]
AIR-_G_TP1  0mm  [SMD Test Point]
AIR_POW_TP1  0mm  [SMD Test Point]  (value not drawn)
C16  100nF  [0805]
C17  100nF  [0805]
C18  10uF  [0805]
C19  100nF  [0805]
C20  100nF  [0805]
C21  10uF  [0805]
C22  100nF  [0805]
C23  100nF  [0805]
C24  10uF  [0805]
D2  SD560BTR  [SMB Diode]
D3  Orange  [0805 LED]
D4  SD560BTR  [SMB Diode]
D5  Orange  [0805 LED]
D6  SD560BTR  [SMB Diode]
D7  Orange  [0805 LED]
PCH_G_TP1  0mm  [SMD Test Point]
Precharge_FET1  STD70N10F4  [SOT-343_N]
R4  680R  [0805]
R5  1.5k  [0805]
R6  1.5k  [0805]
R7  20k  [0805]
R8  20k  [0805]
R9  20k  [0805]
R10  680R  [0805]
R11  1k  [B TO-263]
R12  20k  [0805]
R13  1.5k  [0805]
R14  1k  [B TO-263]
R15  1.5k  [0805]
R16  1k  [B TO-263]
R17  1k  [B TO-263]
R18  20k  [0805]
R19  20k  [0805]
R20  680R  [0805]
R21  1.5k  [0805]
R22  1.5k  [0805]
R23  20k  [0805]
R24  20k  [0805]
R25  20k  [0805]
U7  LTV-817S-TA1  [ON 4-SMD]
U8  ADUM4120  [AD 6-SOIC]
U9  LTV-817S-TA1  [ON 4-SMD]
U10  DAT70510  [C3 SPST]  (parts A,B of 2)
U11  ADUM4120  [AD 6-SOIC]
U12  LTV-817S-TA1  [ON 4-SMD]
U13  ADUM4120  [AD 6-SOIC]

### Ports
AIR Power (ISO), AIR+, AIR+ (ISO), AIR+ Feedback (ISO), AIR+ Feedback In (in), AIR+ Feedback Out (out), AIR-, AIR- (ISO), AIR- Feedback (ISO), AIR- Feedback In (in), AIR- Feedback Out (out), HV Battery+, HV MC+, Precharge Relay (ISO)

### Nets
0V: Precharge_FET1.S R19.1 U8.4(GND2) U11.4(GND2) U13.4(GND2) ; port AIR- Feedback In, port AIR+ Feedback In  [project net AIR+ Feedback In]
0V (ISO): C16.1 C19.1 C22.1 R7.1 R8.1 R12.1 R18.1 R23.1 R24.1 U8.3(GND1) U11.3(GND1) U13.3(GND1)
5V: C17.2 C18.2 C20.2 C21.2 C23.2 C24.2 D4.K R15.2 U7.1(A) U8.6(VDD2) U10.4 U11.6(VDD2) U12.1(A) U13.6(VDD2)
5V (ISO): C16.2 C19.2 C22.2 U7.4(C) U8.1(VDD1) U9.4(C) U11.1(VDD1) U12.4(C) U13.1(VDD1)
AIR Power: D2.K D6.K R6.2 R22.2 U9.1(A)
GLV-: AIR+_FET1.S AIR-_FET1.S C17.1 C18.1 C20.1 C21.1 C23.1 C24.1 R9.1 R13.2 R25.1
AIR+: AIR+_FET1.D D6.A D7.K ; port AIR+
AIR+ Feedback Out: R21.2 ; port AIR+ Feedback Out
AIR-: AIR-_FET1.D D2.A D3.K ; port AIR-
AIR- Feedback Out: R5.2 ; port AIR- Feedback Out
PA2: AIR-_FB_ISO_TP1.1 R4.1 ; port AIR- Feedback (ISO)
PA3: AIR+_FB_ISO1.1 R20.1 ; port AIR+ Feedback (ISO)
PA5: R8.2 U8.2(VIN) ; port AIR- (ISO)
PA6: R18.2 U11.2(VIN) ; port Precharge Relay (ISO)
PA7: R24.2 U13.2(VIN) ; port AIR+ (ISO)
NetAIR+_FET1_G: AIR+_FET1.G AIR+_G_TP1.1 R25.2 U13.5(VOUT)
NetAIR-_FET1_G: AIR-_FET1.G AIR-_G_TP1.1 R9.2 U8.5(VOUT)
NetAIR_POW_TP1_1: AIR_POW_TP1.1 R10.1 ; port AIR Power (ISO)
NetD3_A: D3.A R6.1
NetD4_A: D4.A D5.K Precharge_FET1.D U10.3
NetD5_A: D5.A R15.1
NetD7_A: D7.A R22.1
NetPCH_G_TP1_1: PCH_G_TP1.1 Precharge_FET1.G R19.2 U11.5(VOUT)
NetR4_2: R4.2 R7.2 U7.3(E)
NetR5_1: R5.1 U7.2(K)
NetR10_2: R10.2 R12.2 U9.3(E)
NetR11_1: R11.1 R14.2
NetR11_2: R11.2 ; port HV MC+
NetR13_1: R13.1 U9.2(K)
NetR16_1: R16.1 R17.2
NetR16_2: R16.2 U10.1
NetR17_1: R17.1 ; port HV Battery+
NetR20_2: R20.2 R23.2 U12.3(E)
NetR21_1: R21.1 U12.2(K)

Not connected (* = marked no-connect by the designer): R14 1; U10 2

### Notes on the sheet
- 18mW: GATE DRIVER x2
- 0.6W: REED SWITCH
- ISOLATED
- VEHICLE
- HIGH VOLTAGE
- https://www.digikey.com/products/en?mpart=3350-4275-056&v=1835
- Consider Replacing with this! <https://www.digikey.com/products/en?mpart=3350-4275-056&v=1835>
- Title
- Size:
- Date:
- A3
- Number:
- Time:
- Revision:
- Sheet
- of
- File:

### Library data of the parts
AIR+_FB_ISO1 AIR+_G_TP1 AIR-_FB_ISO_TP1 AIR-_G_TP1 AIR_POW_TP1 PCH_G_TP1 = SMD Test Point: as ?#1 on sheet Power Supply; Part Number: SMD Test Point; Pitch: 0mm; Angle: 0
AIR+_FET1 AIR-_FET1 Precharge_FET1 = STD70N10F4: N-Channel 100V 60A (Tc) 125W (Tc) Surface Mount DPAK; Manufacturer: STMicroelectronics; Published: 24-Mar-1999; LatestRevisionDate: 29-May-2009; LatestRevisionNote: IPC-7351 Footprint Added.; PackageVersion: Sep-2000; PackageReference: SOT-343; Publisher: Altium Limited; PackageDescription: 4-Pin SOT-343 Package 1.3 mm Pitch, 2.1 mm Lead Span; Part Number: STD70N10F4; Digikey Part Number: 497-8806-2-ND; Digikey Link: https://www.digikey.com/product-detail/en/stmicroelectronics/STD70N10F4/497-8806-2-ND/2035599
C16 C17 C19 C20 C22 C23 = GCM21BR71E104KA37L: as C2 on sheet CAN; Part Number: GCM21BR71E104KA37L; Value: 100nF
C18 C21 C24 = GCM21BR61A106KA37L: Manufacturer: muRata; Tolerance: 10%; Material: X5R; Rated Voltage: 10V; Part Number: GCM21BR61A106KA37L; Value: 10uF
D2 D4 D6 = SD560BTR: as D?#1 on sheet Power Supply; Part Number: SD560BTR; Digikey Part Number: 1655-1530-2-ND; Digikey Link: https://www.digikey.com/product-detail/en/smc-diode-solutions/SD560BTR/1655-1530-2-ND/6022620
D3 D5 D7 = SML-211DTT86: Orange LED Indication - Discrete 1.75V 0805 (2012 Metric); Manufacturer: ROHM Semiconductor; Part Number: SML-211DTT86; Colour: Orange; Digikey Part Number: 511-1291-1-ND; Digikey Link: https://www.digikey.com/product-detail/en/rohm-semiconductor/SML-211DTT86/511-1291-1-ND/637104
R4 R10 R20 = RC0805FR07680RL: as R?#1 on sheet Power Supply; Part Number: RC0805FR07680RL; Value: 680R; Material: FR-07
R5 R6 R13 R15 R21 R22 = RC0805FR071K5L: as R26 on sheet Safety Loops; Part Number: RC0805FR071K5L; Value: 1.5k; Material: FR-07
R7-R9 R12 R18 R19 R23-R25 = RC0805FR0720KL: as R29 on sheet Safety Loops; Part Number: RC0805FR0720KL; Value: 20k; Material: FR-07
R11 R14 R16 R17 = PWR263S-35-1001J: Manufacturer: Bournes Inc; Tolerance: 0.05; Rated Voltage: 35W; Part Number: PWR263S-35-1001J; Value: 1k; Digikey Part Number: PWR263S-35-1001J-ND
U7 U9 U12 = LTV-817S-TA1: as U14 on sheet Safety Loops; Part Number: LTV-817S-TA1; Digikey Part Number: 160-1893-2-ND; Digikey Link: https://www.digikey.com/product-detail/en/lite-on-inc/LTV-817S-TA1/160-1893-2-ND/388451
U8 U11 U13 = ADUM4120: DGTL ISO 5KV 1CH GATE DRVR 6SOIC; Manufacturer: Analogue Devices; Part Number: ADUM4120; Digikey Part Number: ADUM4120-1ARIZ-ND; Digikey Link: https://www.digikey.com/product-detail/en/analog-devices-inc/ADUM4120-1ARIZ/ADUM4120-1ARIZ-ND/7324273
U10 = DAT70510: RELAY REED SPST-NO 2A 12V; Manufacturer: Cynergy 3; Part Number: DAT70510; Digikey Part Number: 725-1038-ND; Digikey Link: https://www.digikey.com.au/product-detail/en/cynergy-3/DBT70510/725-1038-ND/752033

## Sheet Sensors.SchDoc
size A3
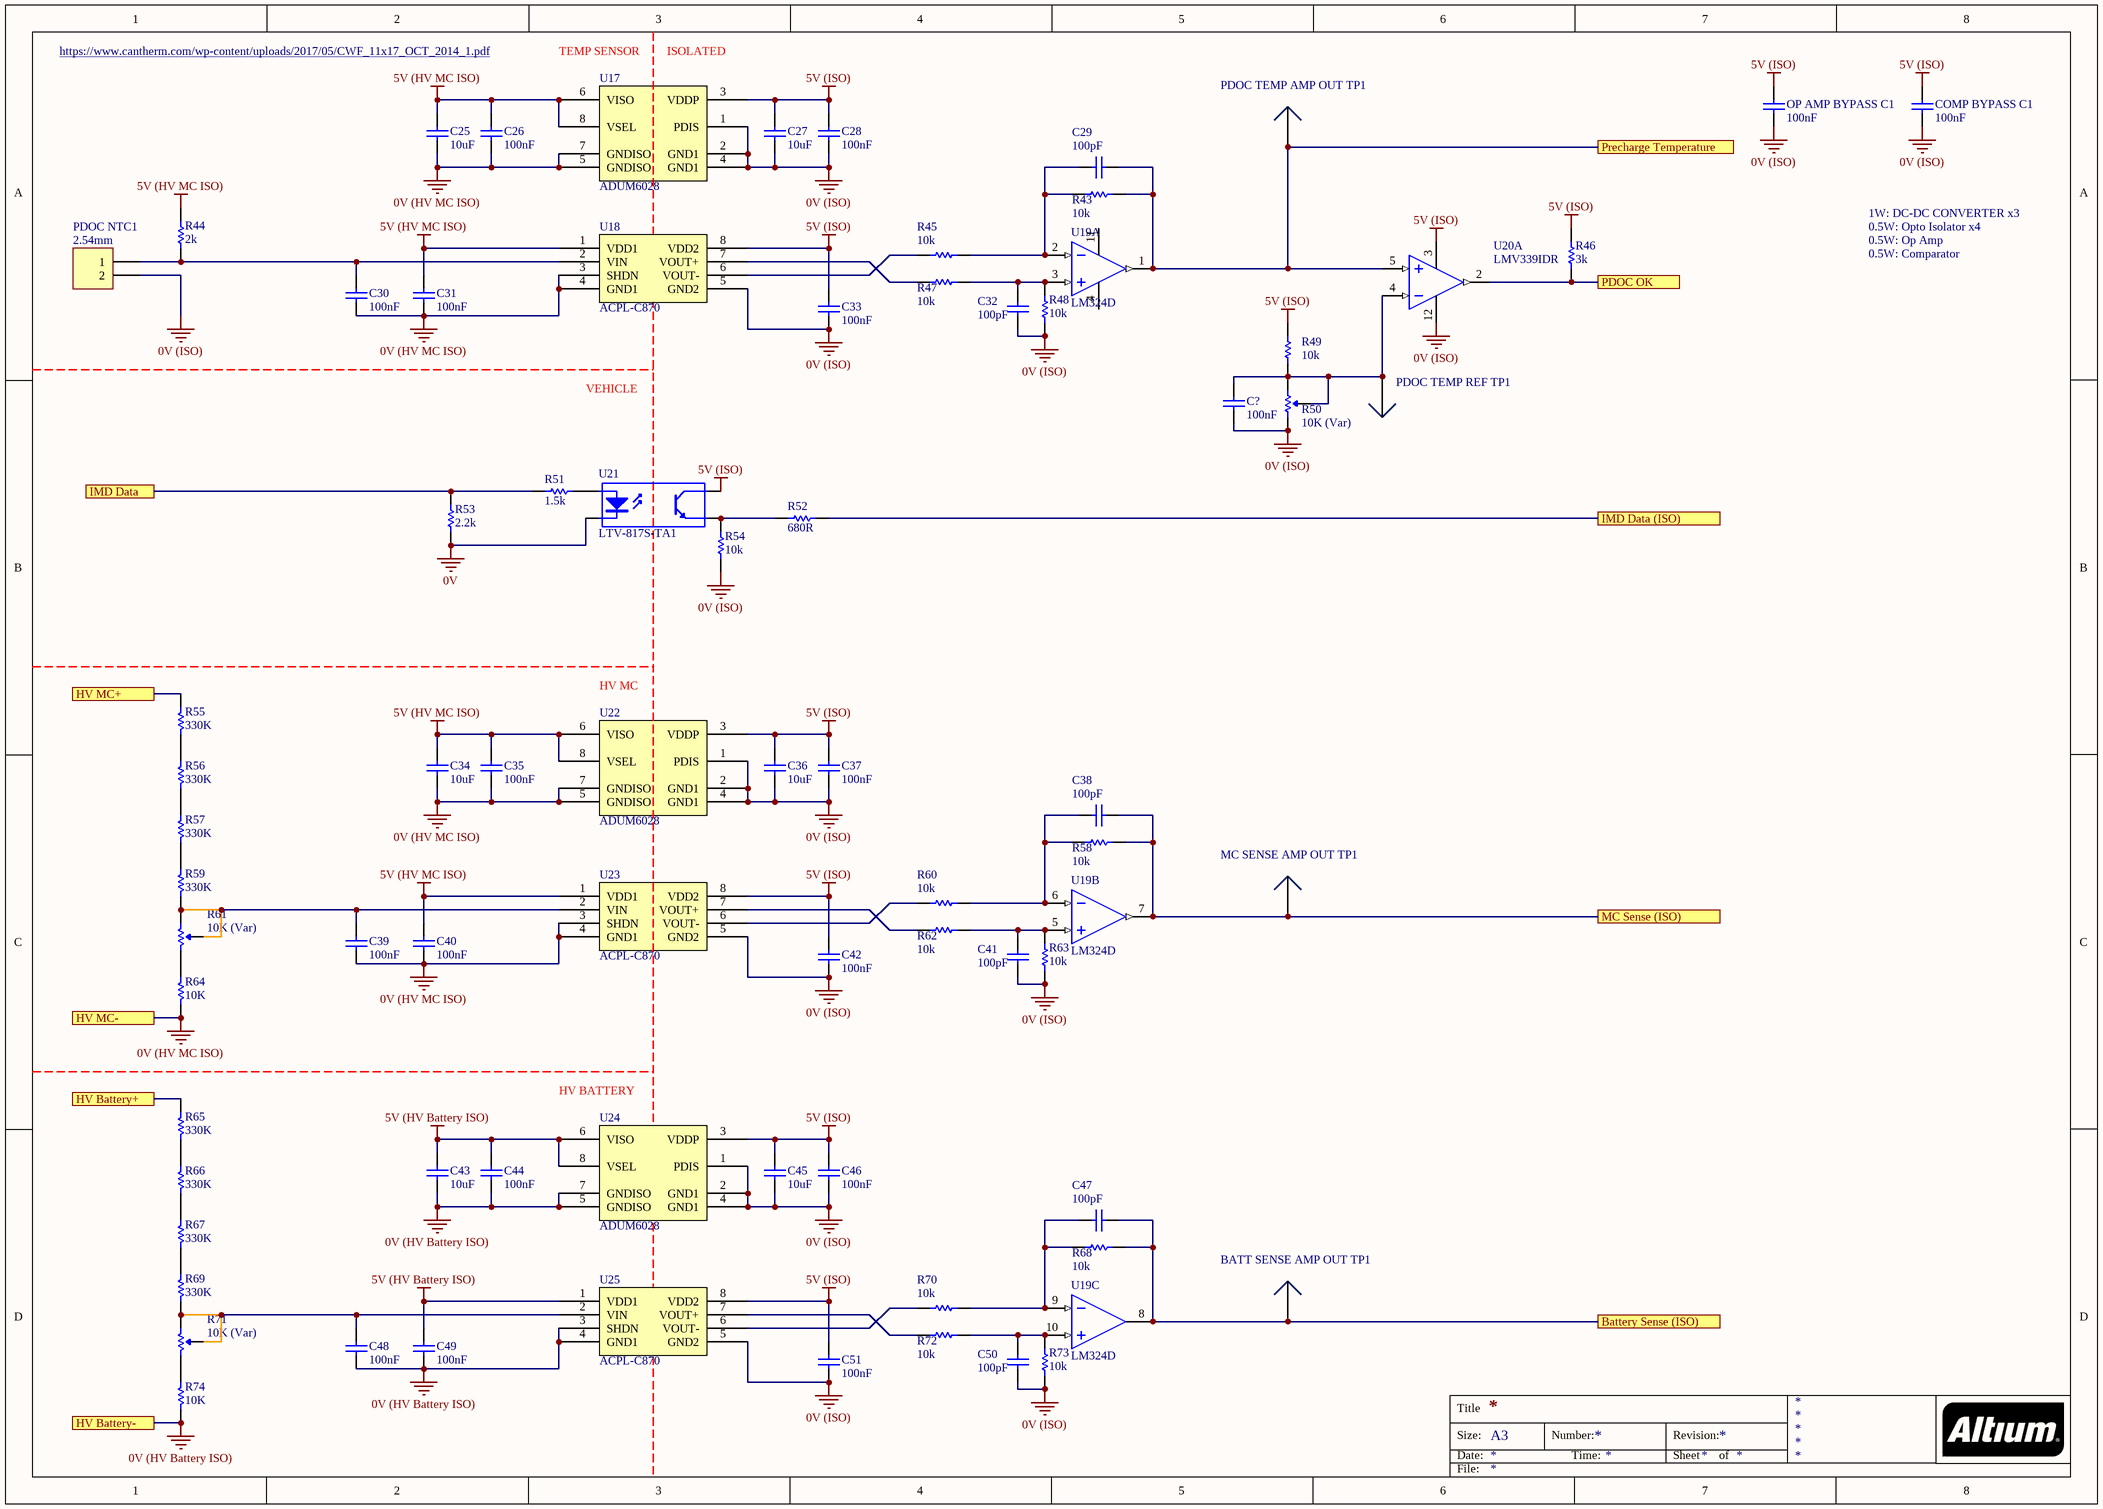
[diagram p6: Sensors.SchDoc]

### Parts
(Parts that share a designator on the sheet are numbered #1, #2 ... from top to bottom, then left to right.)
BATT_SENSE_AMP_OUT_TP1  0mm  [SMD Test Point]  (value not drawn)
C25  10uF  [0805]
C26  100nF  [0805]
C27  10uF  [0805]
C28  100nF  [0805]
C29  100pF  [0805]
C30  100nF  [0805]
C31  100nF  [0805]
C32  100pF  [0805]
C33  100nF  [0805]
C34  10uF  [0805]
C35  100nF  [0805]
C36  10uF  [0805]
C37  100nF  [0805]
C38  100pF  [0805]
C39  100nF  [0805]
C40  100nF  [0805]
C41  100pF  [0805]
C42  100nF  [0805]
C43  10uF  [0805]
C44  100nF  [0805]
C45  10uF  [0805]
C46  100nF  [0805]
C47  100pF  [0805]
C48  100nF  [0805]
C49  100nF  [0805]
C50  100pF  [0805]
C51  100nF  [0805]
C?#6  100nF  [0805]
COMP_BYPASS_C1  100nF  [0805]
MC_SENSE_AMP_OUT_TP1  0mm  [SMD Test Point]  (value not drawn)
OP_AMP_BYPASS_C1  100nF  [0805]
PDOC_NTC1  2.54mm  [TH 2.54mm Header 1x2]
PDOC_TEMP_AMP_OUT_TP1  0mm  [SMD Test Point]  (value not drawn)
PDOC_TEMP_REF_TP1  0mm  [SMD Test Point]  (value not drawn)
R43  10k  [0805]
R44  2k  [0805]
R45  10k  [0805]
R46  3k  [0805]
R47  10k  [0805]
R48  10k  [0805]
R49  10k  [0805]
R50  10K (Var)  [B 3296]
R51  1.5k  [0805]
R52  680R  [0805]
R53  2.2k  [0805]
R54  10k  [0805]
R55  330K  [VB 0207]
R56  330K  [VB 0207]
R57  330K  [VB 0207]
R58  10k  [0805]
R59  330K  [VB 0207]
R60  10k  [0805]
R61  10K (Var)  [B 3296]
R62  10k  [0805]
R63  10k  [0805]
R64  10K  [VB 0207]
R65  330K  [VB 0207]
R66  330K  [VB 0207]
R67  330K  [VB 0207]
R68  10k  [0805]
R69  330K  [VB 0207]
R70  10k  [0805]
R71  10K (Var)  [B 3296]
R72  10k  [0805]
R73  10k  [0805]
R74  10K  [VB 0207]
U17  ADUM6028  [AD 8-SOIC-W]
U18  ACPL-C870  [BROAD 8-SOIC]
U19  LM324D  [TI 14-SOIC]  (parts A,B,C of 4)
U20  LMV339IDR  [TI 14-SOIC]  (part A of 4)
U21  LTV-817S-TA1  [ON 4-SMD]
U22  ADUM6028  [AD 8-SOIC-W]
U23  ACPL-C870  [BROAD 8-SOIC]
U24  ADUM6028  [AD 8-SOIC-W]
U25  ACPL-C870  [BROAD 8-SOIC]

### Ports
Battery Sense (ISO), HV Battery+, HV Battery-, HV MC+, HV MC-, IMD Data, IMD Data (ISO), MC Sense (ISO), PDOC OK, Precharge Temperature

### Nets
0V: R53.1 U21.2(K)  [project net AIR+ Feedback In]
0V (HV Battery ISO): C43.1 C44.1 C48.1 C49.1 R74.1 U24.5(GNDISO) U24.7(GNDISO) U25.3(SHDN) U25.4(GND1) ; port HV Battery-  [project net HV Battery-]
0V (HV MC ISO): C25.1 C26.1 C30.1 C31.1 C34.1 C35.1 C39.1 C40.1 R64.1 U17.5(GNDISO) U17.7(GNDISO) U18.3(SHDN) U18.4(GND1) U22.5(GNDISO) U22.7(GNDISO) U23.3(SHDN) U23.4(GND1) ; port HV MC-  [project net HV MC-]
0V (ISO): C27.1 C28.1 C32.1 C33.1 C36.1 C37.1 C41.1 C42.1 C45.1 C46.1 C50.1 C51.1 C?#6.1 COMP_BYPASS_C1.1 OP_AMP_BYPASS_C1.1 PDOC_NTC1.2 R48.1 R50.3(CW) R54.1 R63.1 R73.1 U17.1(PDIS) U17.2(GND1) U17.4(GND1) U18.5(GND2) U20.12(V-) U22.1(PDIS) U22.2(GND1) U22.4(GND1) U23.5(GND2) U24.1(PDIS) U24.2(GND1) U24.4(GND1) U25.5(GND2)
5V (HV Battery ISO): C43.2 C44.2 C49.2 U24.6(VISO) U24.8(VSEL) U25.1(VDD1)
5V (HV MC ISO): C25.2 C26.2 C31.2 C34.2 C35.2 C40.2 R44.2 U17.6(VISO) U17.8(VSEL) U18.1(VDD1) U22.6(VISO) U22.8(VSEL) U23.1(VDD1)
5V (ISO): C27.2 C28.2 C33.2 C36.2 C37.2 C42.2 C45.2 C46.2 C51.2 COMP_BYPASS_C1.2 OP_AMP_BYPASS_C1.2 R46.2 R49.2 U17.3(VDDP) U18.8(VDD2) U20.3(V+) U21.4(C) U22.3(VDDP) U23.8(VDD2) U24.3(VDDP) U25.8(VDD2)
HV Battery+: R65.2 ; port HV Battery+
HV MC+: R55.2 ; port HV MC+
IMD Data: R51.1 R53.2 ; port IMD Data
PB15: R46.1 U20.2(OUT_A) ; port PDOC OK
NetBATT_SENSE_AMP_OUT_TP1_1: BATT_SENSE_AMP_OUT_TP1.1 C47.2 R68.2 U19.8(3OUT) ; port Battery Sense (ISO)
NetC29_1: C29.1 R43.1 R45.2 U19.2(1IN+)
NetC29_2: C29.2 PDOC_TEMP_AMP_OUT_TP1.1 R43.2 U19.1(1OUT) U20.5(IN_A+) ; port Precharge Temperature
NetC30_2: C30.2 PDOC_NTC1.1 R44.1 U18.2(VIN)
NetC32_2: C32.2 R47.2 R48.2 U19.3(1IN+)
NetC38_1: C38.1 R58.1 R60.2 U19.6(2IN-)
NetC38_2: C38.2 MC_SENSE_AMP_OUT_TP1.1 R58.2 U19.7(2OUT) ; port MC Sense (ISO)
NetC39_2: C39.2 R59.1 R61.2(Wiper) R61.3(CW) U23.2(VIN)
NetC41_2: C41.2 R62.2 R63.2 U19.5(2IN+)
NetC47_1: C47.1 R68.1 R70.2 U19.9(3IN-)
NetC48_2: C48.2 R69.1 R71.2(Wiper) R71.3(CW) U25.2(VIN)
NetC50_2: C50.2 R72.2 R73.2 U19.10(3IN+)
NetC?#6_2: C?#6.2 PDOC_TEMP_REF_TP1.1 R49.1 R50.1(CCW) R50.2(Wiper) U20.4(IN_A-)
NetR45_1: R45.1 U18.6(VOUT-)
NetR47_1: R47.1 U18.7(VOUT+)
NetR51_2: R51.2 U21.1(A)
NetR52_1: R52.1 R54.2 U21.3(E)
NetR52_2: R52.2 ; port IMD Data (ISO)
NetR55_1: R55.1 R56.2
NetR56_1: R56.1 R57.2
NetR57_1: R57.1 R59.2
NetR60_1: R60.1 U23.6(VOUT-)
NetR61_1: R61.1(CCW) R64.2
NetR62_1: R62.1 U23.7(VOUT+)
NetR65_1: R65.1 R66.2
NetR66_1: R66.1 R67.2
NetR67_1: R67.1 R69.2
NetR70_1: R70.1 U25.6(VOUT-)
NetR71_1: R71.1(CCW) R74.2
NetR72_1: R72.1 U25.7(VOUT+)

Not connected (* = marked no-connect by the designer): U19 4(VCC) 11(GND)

### Notes on the sheet
- https://www.cantherm.com/wp-content/uploads/2017/05/CWF_11x17_OCT_2014_1.pdf
- (near U17) TEMP SENSOR
- (near U17) ISOLATED
- 1W: DC-DC CONVERTER x3
- 0.5W: Opto Isolator x4
- 0.5W: Op Amp
- 0.5W: Comparator
- VEHICLE
- (near U22) HV MC
- (near U24) HV BATTERY
- Title
- Size:
- Date:
- A3
- Number:
- Time:
- Revision:
- Sheet
- of
- File:

### Library data of the parts
BATT_SENSE_AMP_OUT_TP1 MC_SENSE_AMP_OUT_TP1 PDOC_TEMP_AMP_OUT_TP1 PDOC_TEMP_REF_TP1 = SMD Test Point: as ?#1 on sheet Power Supply; Part Number: SMD Test Point; Pitch: 0mm; Angle: 0
C25 C27 C34 C36 C43 C45 = GRM21BR6YA106KE43L: as C5 on sheet CAN; Part Number: GRM21BR6YA106KE43L; Value: 10uF; Digikey Part Number: 490-10514-6-ND
C26 C28 C30 C31 C33 C35 C37 C39 C40 C42 C44 C46 C48 C49 C51 C?#6 = GCM21BR71E104KA37L: as C2 on sheet CAN; Part Number: GCM21BR71E104KA37L; Value: 100nF
C29 C32 C38 C41 C47 C50 = GCM21B5C1H101JA37L: as C10 on sheet CAN; Part Number: GCM21B5C1H101JA37L; Value: 100pF
COMP_BYPASS_C1 OP_AMP_BYPASS_C1 = GCM21BR71E104KA37L: Manufacturer: muRata; Tolerance: 10%; Rated Voltage: 25V; Part Number: GCM21BR71E104KA37L; Value: 100nF; Material: X7R
PDOC_NTC1 = TH 2.54mm Header 1x2: as AMS_Bypass1 on sheet Safety Loops; Part Number: TH 2.54mm Header 1x2; Pitch: 2.54mm; Row Spacing: 2.54mm
R43 R45 R47-R49 R54 R58 R60 R62 R63 R68 R70 R72 R73 = RC0805FR0710KL: as R75 on sheet STM32; Part Number: RC0805FR0710KL; Value: 10k; Material: FR-07
R44 = RC0805FR072KL: Manufacturer: YAGEO; Tolerance: 0.01; Rated Voltage: 0.125W; Part Number: RC0805FR072KL; Value: 2k; Material: FR-07
R46 = RC0805FR073KL: Manufacturer: YAGEO; Tolerance: 0.01; Rated Voltage: 0.125W; Part Number: RC0805FR073KL; Value: 3k; Material: FR-07
R50 R61 R71 = 3296W-1-103LF: Manufacturer: Bournes Inc; Tolerance: 0.1; Rated Voltage: 0.5W; Part Number: 3296W-1-103LF; Value: 10K (Var); Digikey Part Number: 3296W-103LF-ND
R51 = RC0805FR071K5L: as R26 on sheet Safety Loops; Part Number: RC0805FR071K5L; Value: 1.5k; Material: FR-07
R52 = RC0805FR07680RL: as R?#1 on sheet Power Supply; Part Number: RC0805FR07680RL; Value: 680R; Material: FR-07
R53 = RC0805FR072K2L: Manufacturer: YAGEO; Tolerance: 0.01; Rated Voltage: 0.125W; Part Number: RC0805FR072K2L; Value: 2.2k; Material: FR-07
R55-R57 R59 R65-R67 R69 = MMB02070C3303FB200: Manufacturer: Vishay Beyschlag; Tolerance: 0.01; Rated Voltage: 1W; Part Number: MMB02070C3303FB200; Value: 330K; Digikey Part Number: MMB-330KBCT-ND
R64 R74 = MMB02070C1002FB200: Manufacturer: Vishay Beyschlag; Tolerance: 0.01; Rated Voltage: 1W; Part Number: MMB02070C1002FB200; Value: 10K; Digikey Part Number: MMB-10KBCT-ND
U17 U22 U24 = ADUM6028: Isolated Module DC DC Converter 1 Output 3.3V, 5V 60mA 4.5V - 5.5V Input; Manufacturer: Analog Devices; Output Voltage: 5V, 3.3V; Output Power: 2W; Efficiency: 0.33; Part Number: ADUM6028; Input Voltage: 4.5V-5.5V; Isolation: Isolated; Digikey Part Number: ADUM6028-5BRIZ-ND; Digikey Link: https://www.digikey.com/product-detail/en/analog-devices-inc/ADUM6028-5BRIZ/ADUM6028-5BRIZ-ND/9485494
U18 U23 U25 = ACPL-C870: Isolation Amplifier 1 Circuit Differential 8-SO; Manufacturer: Broadcom Limited; Part Number: ACPL-C870; Digikey Part Number: 516-2578-5-ND; Digikey Link: https://www.digikey.com/product-detail/en/broadcom-limited/ACPL-C870-000E/516-2578-5-ND/3523705
U19 = LM324D: IC OPAMP GP 4 CIRCUIT 14SOIC; Manufacturer: Texas Instruments; Part Number: LM324D; Digikey Part Number: 296-1390-5-ND; Digikey Link: https://www.digikey.com/product-detail/en/texas-instruments/LM324D/296-1390-5-ND/277039
U20 = LMV339IDR: Comparator General Purpose Open Collector 14-SOIC; Manufacturer: Texas Instruments; Part Number: LMV339IDR; Digikey Part Number: 296-6611-2-ND; Digikey Link: https://www.digikey.com/product-detail/en/texas-instruments/LMV339MTX-NOPB/296-35446-1-ND/3739150
U21 = LTV-817S-TA1: as U14 on sheet Safety Loops; Part Number: LTV-817S-TA1; Digikey Part Number: 160-1893-2-ND; Digikey Link: https://www.digikey.com/product-detail/en/lite-on-inc/LTV-817S-TA1/160-1893-2-ND/388451

## Nets that join several sheets
0V (ISO): CAN (9 pins), Power Supply (?#4.1 C?#5.1 R?#2.1 U?#1.4), STM32 (31 pins), Safety Loops (11 pins), Precharge (12 pins), Sensors (34 pins)
3.3V (ISO): Power Supply (?#2.1 C?#5.2 D?#3.A U?#1.5), STM32 (19 pins)
5V: Power Supply (5 pins), Safety Loops (U15.1 U16.1), Precharge (14 pins)
5V (ISO): CAN (6 pins), STM32 (C58.2 R77.2 U27.1 U27.3), Safety Loops (19 pins), Precharge (9 pins), Sensors (21 pins)
AIR+ Feedback In: Top Level (PRIMARY_INTERFACE.9 PRIMARY_INTERFACE.19 PRIMARY_INTERFACE.23), Power Supply (7 pins), Precharge (5 pins), Sensors (R53.1 U21.2)
GLV-: Safety Loops (R30.1), Precharge (11 pins)
HV Battery-: Top Level (HV_BATTERY-.1 HV_BATTERY-.2), Sensors (9 pins)
HV MC-: Top Level (HV_IMD-.1 HV_IMD-.2 HV_MC-.1 HV_MC-.2), Sensors (17 pins)
AIR+: Top Level (PRIMARY_INTERFACE.20), Precharge (AIR+_FET1.D D6.A D7.K)
AIR+ Feedback Out: Top Level (PRIMARY_INTERFACE.17), Precharge (R21.2)
AIR-: Top Level (PRIMARY_INTERFACE.24), Precharge (AIR-_FET1.D D2.A D3.K)
AIR- Feedback Out: Top Level (PRIMARY_INTERFACE.21), Precharge (R5.2)
AMS OK: Top Level (PRIMARY_INTERFACE.12), Safety Loops (R35.1)
CANH: Top Level (PRIMARY_INTERFACE.3), CAN (C11.2 CAN_TERM_R1.2 U2.2)
CANL: Top Level (PRIMARY_INTERFACE.4), CAN (C10.2 CAN_TERM_R2.1 U2.1)
CANS: Top Level (PRIMARY_INTERFACE.5 PRIMARY_INTERFACE.6), CAN (15 pins)
GLV+: Top Level (IMD_INTERFACE.2 PRIMARY_INTERFACE.1), Power Supply (F?.1 GLV+_TP?.1)
GLV-: Top Level (IMD_INTERFACE.1 PRIMARY_INTERFACE.2 PRIMARY_INTERFACE.16), Power Supply (C?#1.1 C?#2.1 GLV-_TP?.1 U?#2.4)
Green In: Top Level (PRIMARY_INTERFACE.8), Safety Loops (IMD_Bypass1.2 K1.11)
Green Out: Top Level (PRIMARY_INTERFACE.7), Safety Loops (K4.13 PDOC_Bypass1.1)
HV Battery+: Top Level (HV_BATTERY+.1 HV_BATTERY+.2), Sensors (R65.2)
HV MC+: Top Level (HV_IMD+.1 HV_IMD+.2 HV_MC+.1 HV_MC+.2), Sensors (R55.2)
IMD Data: Top Level (IMD_INTERFACE.8), Sensors (R51.1 R53.2)
IMD OK: Top Level (IMD_INTERFACE.6), Safety Loops (U14.1)
PA2: STM32 (U26.12), Precharge (AIR-_FB_ISO_TP1.1 R4.1)
PA3: STM32 (U26.13), Precharge (AIR+_FB_ISO1.1 R20.1)
PA5: STM32 (U26.15), Precharge (R8.2 U8.2)
PA6: STM32 (U26.16), Precharge (R18.2 U11.2)
PA7: STM32 (U26.17), Precharge (R24.2 U13.2)
PB8: CAN (U1.4), STM32 (U26.45)
PB9: CAN (U1.5), STM32 (U26.46)
PB12: STM32 (U26.25), Safety Loops (IMD_OK_TP1.1 Q1.G R28.1 R29.2)
PB13: STM32 (U26.26), Safety Loops (AMS_OK_TP1.1 Q2.G R33.1 R34.2)
PB14: STM32 (U26.27), Safety Loops (Q3.G R38.1 R40.2 TS_OK_TP1.1)
PB15: STM32 (U26.28), Sensors (R46.1 U20.2)
TS Out: Top Level (PRIMARY_INTERFACE.10), Safety Loops (R39.2)